# Altium project RoboticArm_DevBoard_V2.PrjPcb
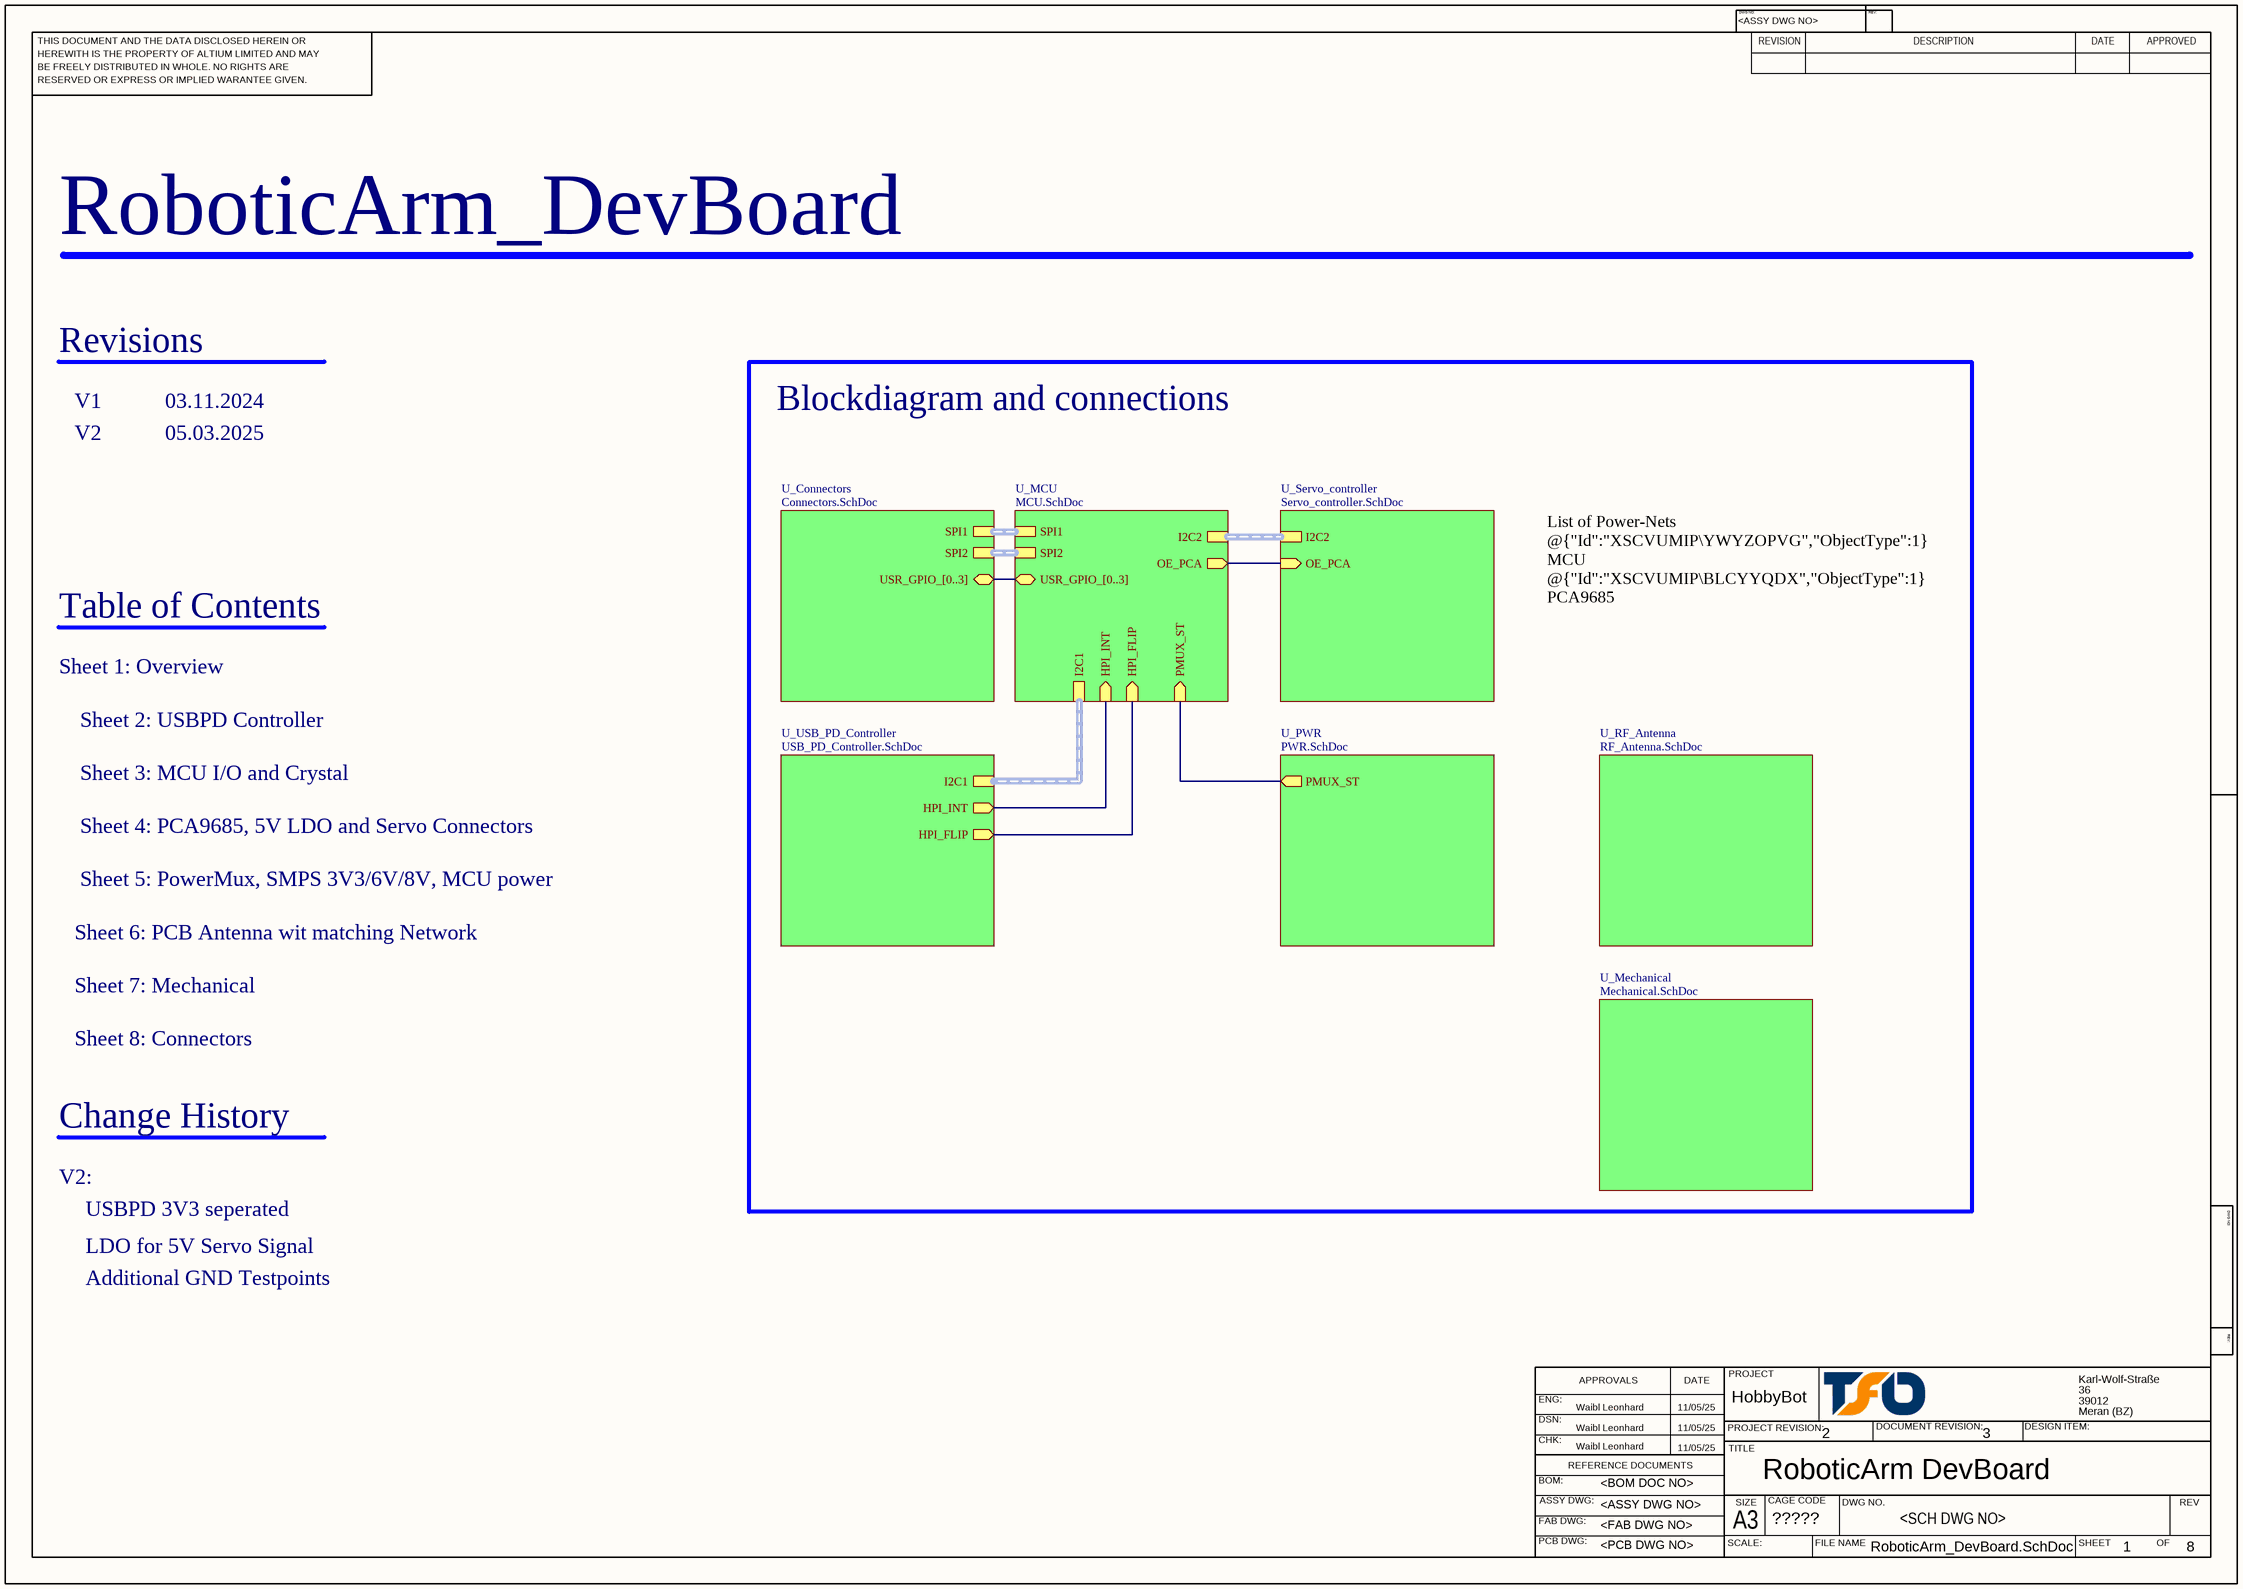
[diagram p0: RoboticArm_DevBoard.SchDoc]
CAGE_CODE: ?????; CONTRACT_NUMBER: <CONTRACT NO>; DOC_NO_ASSY_DWG: <ASSY DWG NO>; DOC_NO_BOM: <BOM DOC NO>; DOC_NO_FAB_DWG: <FAB DWG NO>; DOC_NO_SCH_DWG: <SCH DWG NO>; PCB_2_DEC_TOL: +/-.01; PCB_3_DEC_TOL: +/-.010; PCB_ANG_TOL: +/-1/2; PCB_ASSEMBLY_NO: <PCB ASSY NO>; PCB_CHECKER: - -----; PCB_CHECKER_APP_DATE: --/--/----; PCB_DESIGNER: - -----; PCB_DESIGNER_APP_DATE: --/--/----; PCB_DWG_NO: <PCB DWG NO>; PCB_ENGINEER: - -----; PCB_ENGINEER_APP_DATE: --/--/----; PCB_PART_NUMBER: <PCB PN>; PCB_REV: A; SCH_REV: A
8 sheets, 204 parts. Net scope: hierarchical (ports join the sheet entries above them; power ports are global).
Board file: RoboticArm_DevBoard.PcbDoc
Sheets:
  RoboticArm_DevBoard.SchDoc
    U_MCU = MCU.SchDoc
    U_PWR = PWR.SchDoc
    U_RF_Antenna = RF_Antenna.SchDoc
    U_Servo_controller = Servo_controller.SchDoc
    U_USB_PD_Controller = USB_PD_Controller.SchDoc
    U_Mechanical = Mechanical.SchDoc
    U_Connectors = Connectors.SchDoc

## Sheet RoboticArm_DevBoard.SchDoc: RoboticArm DevBoard
size 420 x 297 mm; Date: 11/05/25; ApprovedBy: Waibl Leonhard; CheckedBy: Waibl Leonhard; Author: Waibl Leonhard; CompanyName: TFO Meran; DrawnBy: Waibl Leonhard; Engineer: Waibl Leonhard; Organization: TFO Meran; Address1: Karl-Wolf-Straße; Address2: 36; Address3: 39012; Address4: Meran (BZ); DocumentNumber: 1; Revision: 2; SheetNumber: 1; SheetTotal: 8; Project: HobbyBot; ENG_APP_DATE: 11/05/25; DSN_APP_DATE: 11/05/25; CHK_APP_DATE: 11/05/25; ProjectRevision: 2; DocumentRevision: 3; ImagePath: C:\Users\Public\Documents\Altium\RoboticArm_DevBoard_V2\images\tfo_logo.jpg; Application_BuildNumber: 2

### Sub-sheets
U_Connectors = Connectors.SchDoc: SPI1 (harness SPI), SPI2 (harness SPI), USR_GPIO_[0..3] (bidir)
U_MCU = MCU.SchDoc: SPI1 (harness *), SPI2 (harness *), I2C1 (harness *), OE_PCA (out), I2C2 (harness *), HPI_FLIP (in), HPI_INT (in), PMUX_ST (in), USR_GPIO_[0..3] (bidir)
U_Mechanical = Mechanical.SchDoc: no entries
U_PWR = PWR.SchDoc: PMUX_ST (out)
U_RF_Antenna = RF_Antenna.SchDoc: no entries
U_Servo_controller = Servo_controller.SchDoc: I2C2 (harness *), OE_PCA (in)
U_USB_PD_Controller = USB_PD_Controller.SchDoc: I2C1 (harness *), HPI_INT (out), HPI_FLIP (out)

### Nets
FLIP: sheet U_MCU/HPI_FLIP, sheet U_USB_PD_Controller/HPI_FLIP
HPI_INT: sheet U_MCU/HPI_INT, sheet U_USB_PD_Controller/HPI_INT
MCU_OE: sheet U_MCU/OE_PCA, sheet U_Servo_controller/OE_PCA
PMUX_ST: sheet U_MCU/PMUX_ST, sheet U_PWR/PMUX_ST

### Buses and harness runs
bus sheet U_Connectors/USR_GPIO_[0..3] = sheet U_MCU/USR_GPIO_[0..3]
harness sheet U_Connectors/SPI1 = sheet U_MCU/SPI1
harness sheet U_Connectors/SPI2 = sheet U_MCU/SPI2
harness sheet U_MCU/I2C1 = sheet U_USB_PD_Controller/I2C1
harness sheet U_MCU/I2C2 = sheet U_Servo_controller/I2C2

### Notes on the sheet
- RoboticArm_DevBoard
- Revisions
- V1
- V2
- 03.11.2024
- 05.03.2025
- Blockdiagram and connections
- Table of Contents
- List of Power-Nets
  @{"Id":"XSCVUMIP\YWYZOPVG","ObjectType":1} MCU
  @{"Id":"XSCVUMIP\BLCYYQDX","ObjectType":1} PCA9685
  @{"Id":"YYHNZXNY\TMXGGDOU","ObjectType":1} Servos
  @{"Id":"YYHNZXNY\GFYATLQU","ObjectType":1} Servos
- Sheet 1: Overview
- Sheet 2: USBPD Controller
- Sheet 3: MCU I/O and Crystal
- Sheet 4: PCA9685, 5V LDO and Servo Connectors
- Sheet 5: PowerMux, SMPS 3V3/6V/8V, MCU power
- Sheet 6: PCB Antenna wit matching Network
- Sheet 7: Mechanical
- Sheet 8: Connectors
- Change History
- V2:
- USBPD 3V3 seperated
- LDO for 5V Servo Signal
- Additional GND Testpoints
- THIS DOCUMENT AND THE DATA DISCLOSED HEREIN OR
- HEREWITH IS THE PROPERTY OF ALTIUM LIMITED AND MAY
- DWG NO:
- REVISION
- REV:
- DESCRIPTION
- DATE
- APPROVED
- BE FREELY DISTRIBUTED IN WHOLE. NO RIGHTS ARE
- RESERVED OR EXPRESS OR IMPLIED WARANTEE GIVEN.
- ENG:
- APPROVALS
- PROJECT
- DSN:
- CHK:
- REFERENCE DOCUMENTS
- PROJECT REVISION:
- TITLE
- DOCUMENT REVISION:
- DESIGN ITEM:
- BOM:
- FAB DWG:
- PCB DWG:
- ASSY DWG:
- SCALE:
- A3
- SIZE
- CAGE CODE
- FILE NAME
- DWG NO.
- SHEET
- OF
- REV

## Sheet MCU.SchDoc
size A3; SheetNumber: 3; SheetTotal: 8
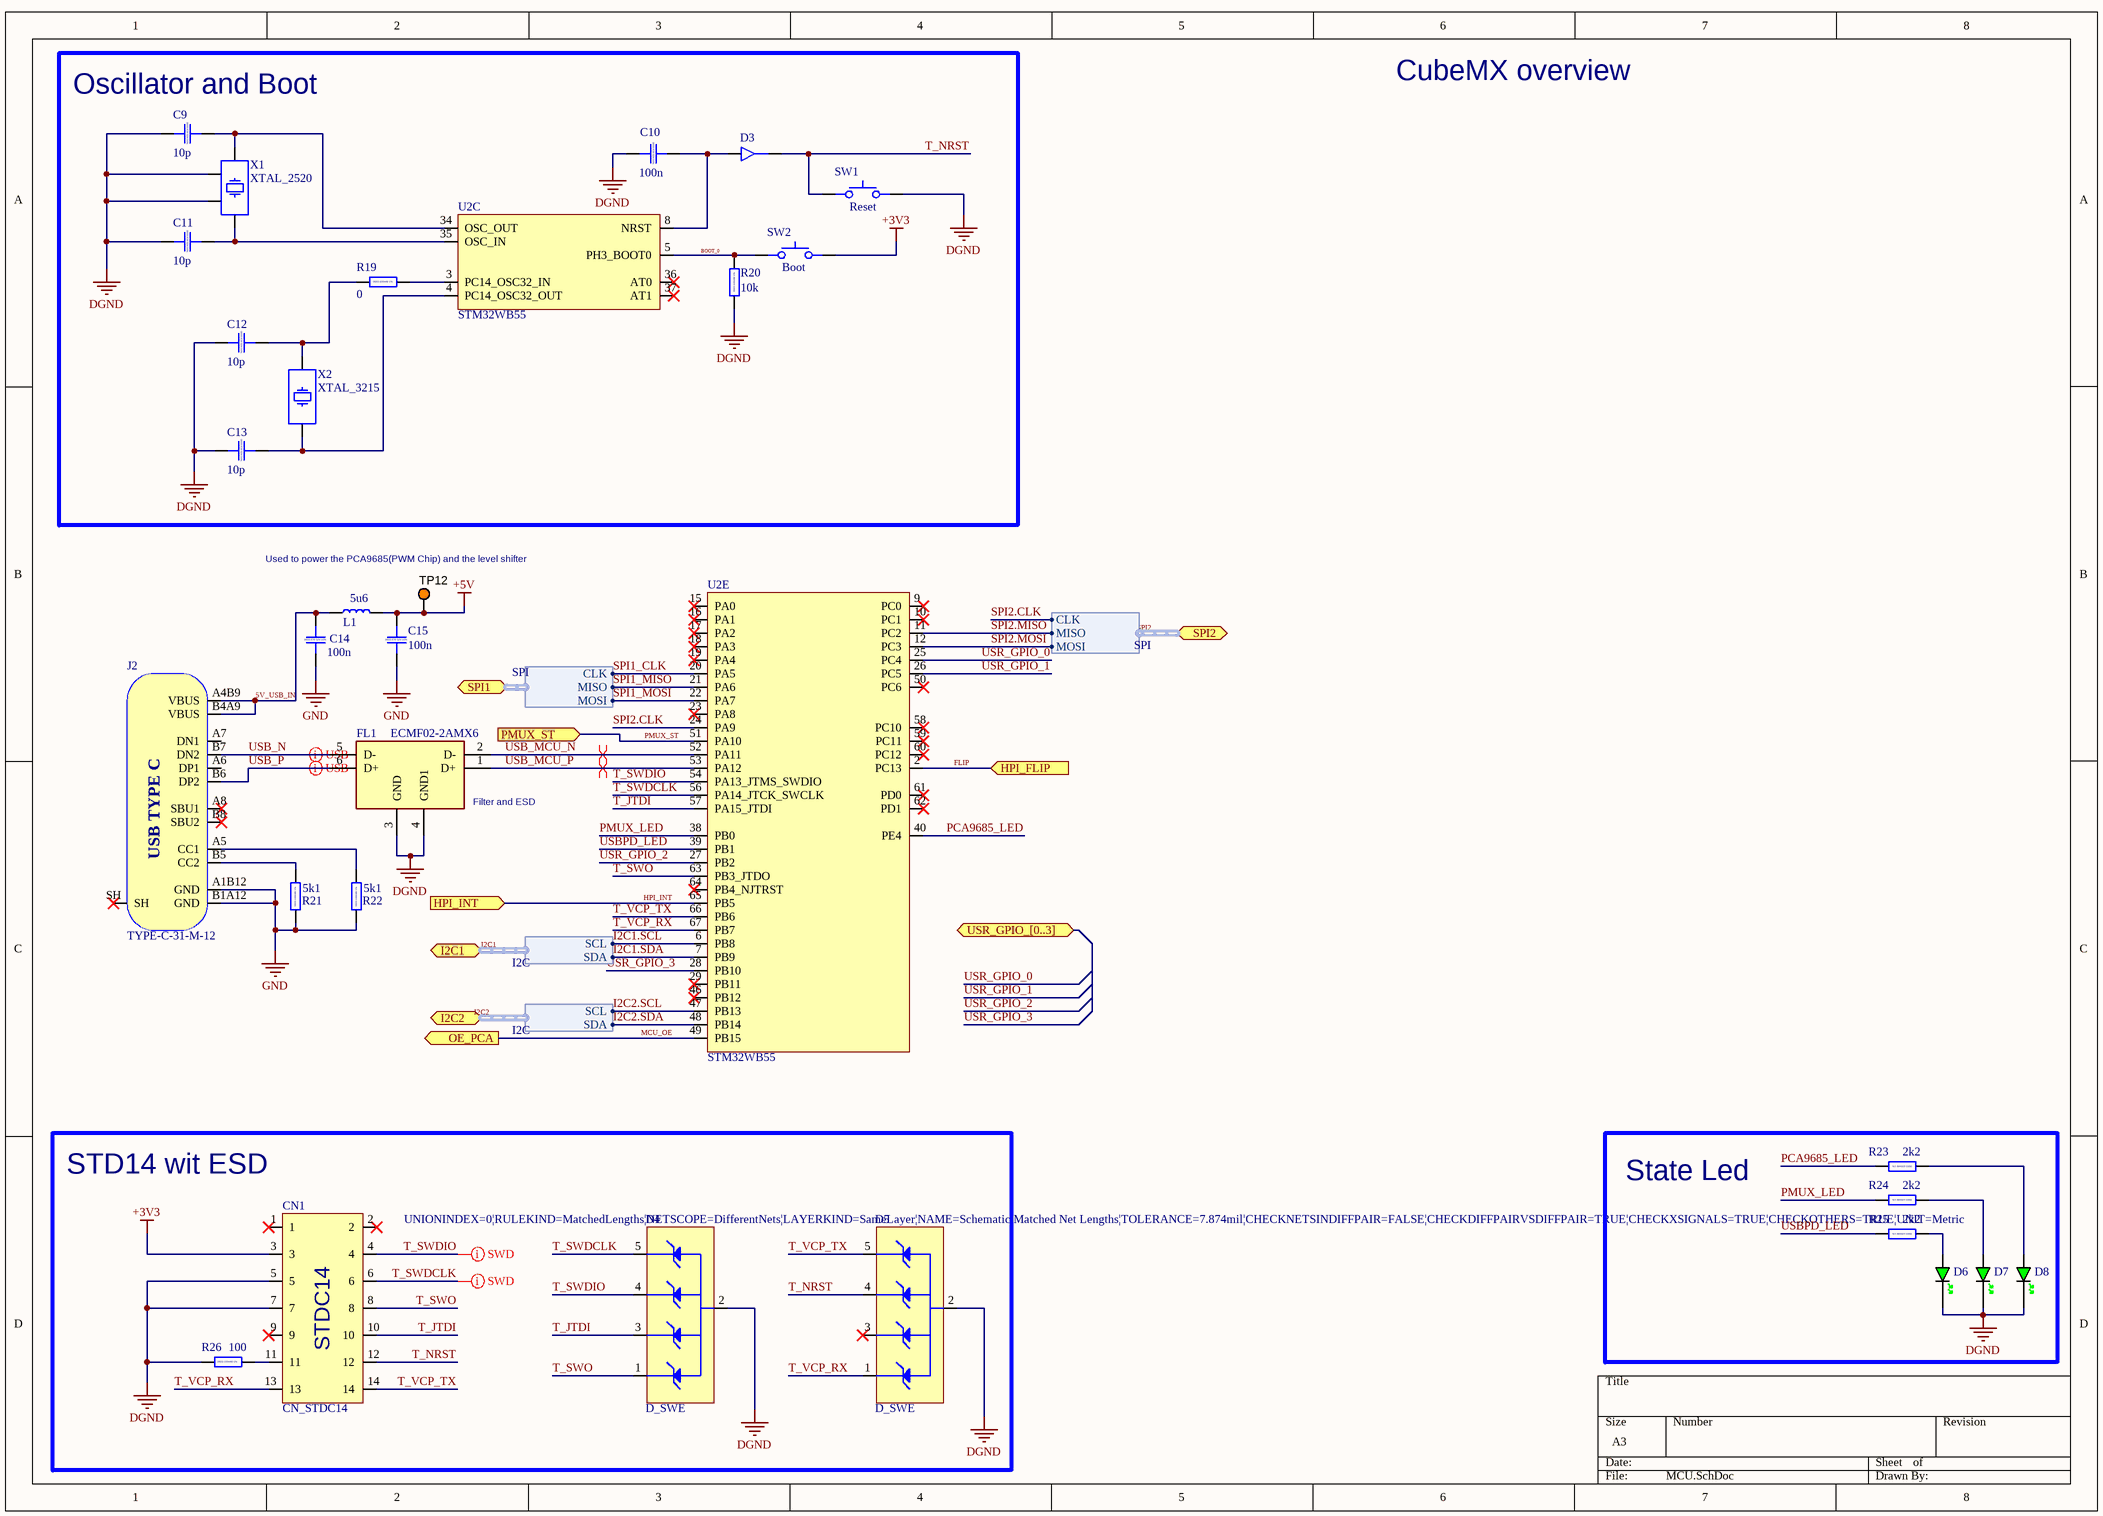
[diagram p1: MCU.SchDoc]

### Parts
C9  10p  [CAP_0603]
C10  100n  [CAP_0603]
C11  10p  [CAP_0603]
C12  10p  [CAP_0603]
C13  10p  [CAP_0603]
C14  100n  [CAP_0603]
C15  100n  [CAP_0603]
CN1  CN_STDC14  [FTSH-107-01-F-DV-K-P-TR-Footprint-1]
D3  D_SOD_323  [SOD-323]  (value not drawn)
D4  D_SWE  [SOT65P210X110-5N]
D5  D_SWE  [SOT65P210X110-5N]
D6  LED_0603_GREEN  [LED_0603_GREEN]  (value not drawn)
D7  LED_0603_GREEN  [LED_0603_GREEN]  (value not drawn)
D8  LED_0603_GREEN  [LED_0603_GREEN]  (value not drawn)
FL1  ECMF02-2AMX6  [FP-QFN-6L-IPC_A]
J2  TYPE-C-31-M-12  [TYPE-C-31-M-12]
L1  5u6  [IND_0603]
R19  0  [RES_0603]
R20  10k  [RES_0603]
R21  5k1  [RES_0603]
R22  5k1  [RES_0603]
R23  2k2  [RES_0603]
R24  2k2  [RES_0603]
R25  2k2  [RES_0603]
R26  100  [RES_0603]
SW1  Reset  [SKRPANE010]
SW2  Boot  [SKRPANE010]
TP12  5003  [KSTN-5003]  (value not drawn)
U2  STM32WB55  [QFN40P800X800X100_HS-69N]  (parts C,E of 5)
X1  XTAL_2520  [XTAL_2520]
X2  XTAL_3215  [XTAL_3215-2]

### Blocks framed on the sheet
Oscillator and Boot: C9-C13 D3 R19 R20 SW1 SW2 U2 X1 X2
STD14 wit ESD: CN1 D4 D5 R26
State Led: D6-D8 R23-R25

### Ports
HPI_FLIP (in), HPI_INT (in), I2C1 (bidir, harness I2C), I2C2 (bidir, harness I2C), OE_PCA (out), PMUX_ST (in), SPI1 (bidir, harness SPI), SPI2 (bidir, harness SPI), USR_GPIO_[0..3] (bidir)

### Harnesses
SPI: CLK, MISO, MOSI
I2C: SCL, SDA

### Nets
+3V3: CN1.3 SW2.34
+5V: C15.1 L1.2 TP12.1
DGND: C9.2 C10.2 C11.2 C12.2 C13.2 CN1.5 CN1.7 D4.2 D5.2 D6.K D7.K D8.K FL1.3(GND) FL1.4(GND1) R20.1 R26.1 SW1.34 X1.2 X1.4
GND: C14.2 C15.2 J2.A1B12(GND) J2.B1A12(GND) R21.1 R22.1
5V_USB_IN: C14.1 J2.A4B9(VBUS) J2.B4A9(VBUS) L1.1
BOOT_0: R20.2 SW2.12 U2.5(PH3_BOOT0)
FLIP: U2.2(PC13) ; port HPI_FLIP
HPI_INT: U2.65(PB5) ; port HPI_INT
I2C1.SCL: U2.6(PB8) ; port I2C1.SCL
I2C1.SDA: U2.7(PB9) ; port I2C1.SDA
I2C2.SCL: U2.47(PB13) ; port I2C2.SCL
I2C2.SDA: U2.48(PB14) ; port I2C2.SDA
MCU_OE: U2.49(PB15) ; port OE_PCA
PCA9685_LED: R23.2 U2.40(PE4)
PMUX_LED: R24.2 U2.38(PB0)
PMUX_ST: U2.51(PA10) ; port PMUX_ST
SPI1_CLK: U2.20(PA5) ; port SPI1.CLK
SPI1_MISO: U2.21(PA6) ; port SPI1.MISO
SPI1_MOSI: U2.22(PA7) ; port SPI1.MOSI
SPI2.CLK: U2.24(PA9) ; port SPI2.CLK
SPI2.MISO: U2.11(PC2) ; port SPI2.MISO
SPI2.MOSI: U2.12(PC3) ; port SPI2.MOSI
T_JTDI: CN1.10 D4.3 U2.57(PA15_JTDI)
T_NRST: CN1.12 D3.K D5.4 SW1.12
T_SWDCLK: CN1.6 D4.5 U2.56(PA14_JTCK_SWCLK)
T_SWDIO: CN1.4 D4.4 U2.54(PA13_JTMS_SWDIO)
T_SWO: CN1.8 D4.1 U2.63(PB3_JTDO)
T_VCP_RX: CN1.13 D5.1 U2.67(PB7)
T_VCP_TX: CN1.14 D5.5 U2.66(PB6)
USB_MCU_N: FL1.2(D-) U2.52(PA11)
USB_MCU_P: FL1.1(D+) U2.53(PA12)
USB_N: FL1.5(D-) J2.B7(DN2)
USB_P: FL1.6(D+) J2.B6(DP2)
USBPD_LED: R25.2 U2.39(PB1)
USR_GPIO_0: U2.25(PC4)
USR_GPIO_1: U2.26(PC5)
USR_GPIO_2: U2.27(PB2)
USR_GPIO_3: U2.28(PB10)
NetC9_1: C9.1 U2.34(OSC_OUT) X1.1
NetC10_1: C10.1 D3.A U2.8(NRST)
NetC11_1: C11.1 U2.35(OSC_IN) X1.3
NetC12_1: C12.1 R19.1 X2.2
NetC13_1: C13.1 U2.4(PC14_OSC32_OUT) X2.1
NetCN1_11: CN1.11 R26.2
NetD6_A: D6.A R25.1
NetD7_A: D7.A R24.1
NetD8_A: D8.A R23.1
NetJ2_A5: J2.A5(CC1) R22.2
NetJ2_B5: J2.B5(CC2) R21.2
NetR19_2: R19.2 U2.3(PC14_OSC32_IN)

Not connected (* = marked no-connect by the designer): CN1 1* 2* 9*; D5 3*; J2 A6(DP1) A7(DN1) A8(SBU1)* B8(SBU2)* SH*; U2 9(PC0)* 10(PC1)* 15(PA0)* 16(PA1)* 17(PA2)* 18(PA3)* 19(PA4)* 23(PA8)* 29(PB11)* 36(AT0)* 37(AT1)* 46(PB12)* 50(PC6)* 58(PC10)* 59(PC11)* 60(PC12)* 61(PD0)* 62(PD1)* 64(PB4_NJTRST)*

### Buses and harness runs
harness I2C1 = port I2C1
harness I2C2 = port I2C2
harness SPI2 = port SPI2

### Layout directives
differential pair; differential pair class DIFF_USB: USB_MCU_N, USB_MCU_P, USB_N, USB_P
rule Matched Net Lengths [Tolerance = 0.2mm]; net class SWDIO: T_SWDCLK, T_SWDIO

### Notes on the sheet
- CubeMX overview
- Used to power the PCA9685(PWM Chip) and the level shifter
- (near FL1) Filter and ESD
- (in symbol CMP-001-00113-3) 0603 X7R 50V 10%
- (in symbol CMP-002-00119-1) USB TYPE C
- (in symbol CMP-002-00331-1) STDC14
- (in symbol CMP-009-00179-5) 0603 100mW 1%

### Library data of the parts
C9-C15 = CMP-001-00113-3: Capacitor SMD 0603; Manufacturer: *; Rating: *; Distributor Link: *; Source: Schematic-Lib-PhilsLab.SchLib; Manufacturer Part Number: *; Dielectric: *; LCSC: *; Design Item ID: CAP_0603
  C9 C11-C13: Value: 10p
  C10 C14 C15: Value: 100n
CN1 = CMP-002-00331-1: Board Connector, 14 Contact(s), 2 Row(s), Male, Straight, 0.05 inch Pitch, Surface Mount Terminal, Locking; RoHS Compliant: Yes; Mounting Technology: Board; Connector Type: BOARD CONNECTOR
D3 = CMP-004-00140-1: Diode SMD SOD-323; Source: Schematic-Lib-PhilsLab.SchLib; Design Item ID: D_SOD_323
D4 D5 = CMP-004-00138-2: ESDALC6V1W5 Trans Voltage Suppressor Diode, 25W, Unidirectional, 4 Element, Silicon; Pins: 5; RoHS Compliant: Yes; Max Operating Temperature: 150°C
D6-D8 = CMP-004-00051-1: LED 0603 GREEN SMD; Source: Schematic-Lib-PhilsLab.SchLib; Design Item ID: LED_0603_GREEN
FL1 = CMP-031-00232-5: Data Line Filter, 2 Function(s), 6 Pin(s), Plastic; Max Operating Temperature: 85°C; Min Operating Temperature: -40°C; Mounting Technology: Surface Mount; RoHS Compliant: Yes; Pins: 6
J2 = CMP-002-00119-1: USB Type C Connector Horizontal SMT; Manufacturer: Koren Hroparts; Source: Schematic-Lib-PhilsLab.SchLib; Manufacturer Part Number: TYPE-C-31-M-12; Design Item ID: TYPE-C-31-M-12
L1 = CMP-006-00026-1: Inductor SMD 0603; Design Item ID: IND_0603; Source: Schematic-Lib-PhilsLab.SchLib
R19-R26 = CMP-009-00179-5: Resistor 0603 100mW 1%; LCSC: *; Distributor Link: *; Manufacturer Part Number: *; Design Item ID: RES_0603; Manufacturer: *; Source: Schematic-Lib-PhilsLab.SchLib
  R19: Value: 0
  R20: Value: 10k
  R21 R22: Value: 5k1
  R23-R25: Value: 2k2
  R26: Value: 100
SW1 SW2 = CMP-011-00019-1: Tactile Switch SMD SPST; Manufacturer: Alps Alpine; Manufacturer Part Number: SKRPANE010; Source: Schematic-Lib-PhilsLab.SchLib; Design Item ID: SKRPANE010
TP12 = CMP-002-00037-2: Test Point, Orange, Height 4.6 mm, Tail Length 3 mm, 1-Pin THD, RoHS; Manufacturer: Keystone; Colour: Orange; Packaging: Bulk; Package Description: 1-Pin Through Hole Device, Dia 2.54 mm; Pins: 1; Package Reference: 5003; Datasheet Version: Jun-15; Case/Package: 5003; Mounting Technology: TH; Connector Type: TestPoint; Diameter: 2.54mm; Contact Material: Bronze; Datasheet URL: http://keyelco.com/userAssets/file/M65p56.pdf; Manufacturer URL: http://www.keyelco.com/; Package Quantity: 10; Contact Plating: Tin; RoHS Compliant: True
U2 = CMP-031-00230-3: Multiprotocol wireless 32-bit MCU Arm®-based Cortex®-M4
X1 = CMP-003-00031-1: Crystal SMD 2520; Distributor Link: *; Design Item ID: XTAL_2520; Source: Schematic-Lib-PhilsLab.SchLib
X2 = CMP-003-00032-1: Crystal SMD 3215; Source: Schematic-Lib-PhilsLab.SchLib; Distributor Link: *; Design Item ID: XTAL_3215

## Sheet PWR.SchDoc
size A3; SheetNumber: 5; SheetTotal: 8
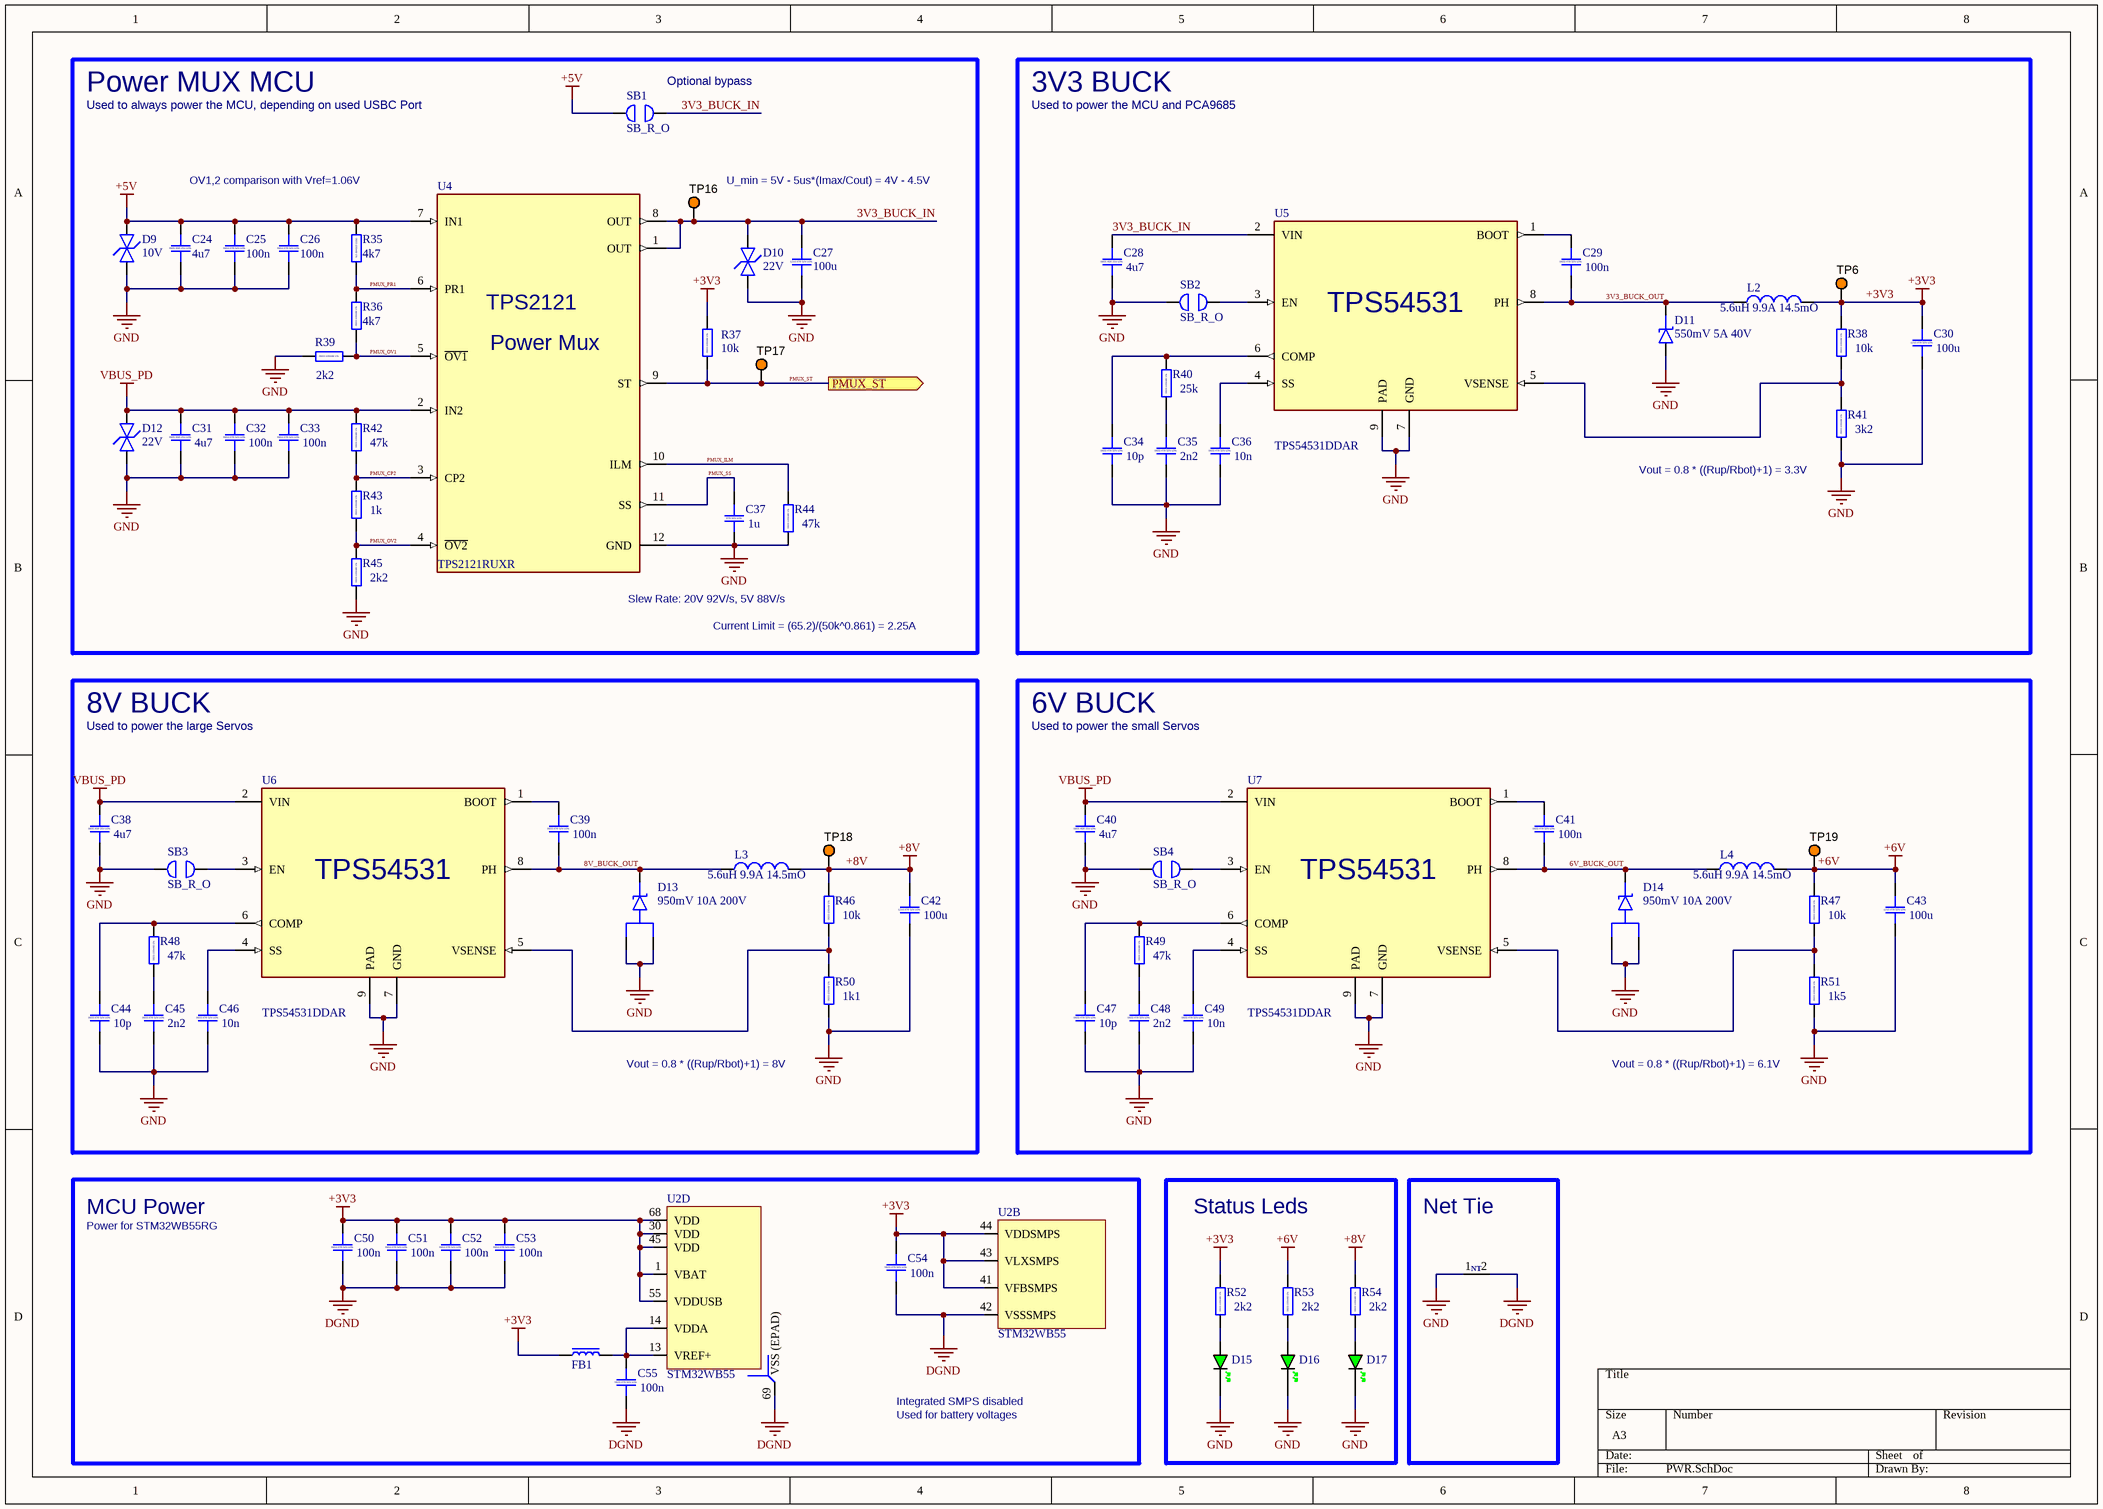
[diagram p2: PWR.SchDoc]

### Parts
C24  4u7  [CAP_0805]
C25  100n  [CAP_0603]
C26  100n  [CAP_0603]
C27  100u  [CAP_1210]
C28  4u7  [CAP_0805]
C29  100n  [CAP_0603]
C30  100u  [CAP_1210]
C31  4u7  [CAP_0805]
C32  100n  [CAP_0603]
C33  100n  [CAP_0603]
C34  10p  [CAP_0603]
C35  2n2  [CAP_0603]
C36  10n  [CAP_0603]
C37  1u  [CAP_0603]
C38  4u7  [CAP_0805]
C39  100n  [CAP_0603]
C40  4u7  [CAP_0805]
C41  100n  [CAP_0603]
C42  100u  [CAP_1210]
C43  100u  [CAP_1210]
C44  10p  [CAP_0603]
C45  2n2  [CAP_0603]
C46  10n  [CAP_0603]
C47  10p  [CAP_0603]
C48  2n2  [CAP_0603]
C49  10n  [CAP_0603]
C50  100n  [CAP_0603]
C51  100n  [CAP_0603]
C52  100n  [CAP_0603]
C53  100n  [CAP_0603]
C54  100n  [CAP_0603]
C55  100n  [CAP_0603]
D9  10V  [D_0603]
D10  22V  [D_0603]
D11  550mV 5A 40V  [SMC-DO-214AB]
D12  22V  [D_0603]
D13  950mV 10A 200V  [DPAK230P970X240-3N]
D14  950mV 10A 200V  [DPAK230P970X240-3N]
D15  LED_0603_GREEN  [LED_0603_GREEN]  (value not drawn)
D16  LED_0603_GREEN  [LED_0603_GREEN]  (value not drawn)
D17  LED_0603_GREEN  [LED_0603_GREEN]  (value not drawn)
FB1  FB_0603  [FB_0603]  (value not drawn)
L2  5.6uH 9.9A 14.5mO  [INDP6466X61N]
L3  5.6uH 9.9A 14.5mO  [INDP6466X61N]
L4  5.6uH 9.9A 14.5mO  [INDP6466X61N]
NT1  NetTie_1mm  [NETTIE]  (value not drawn)  (net tie, no BOM)
R35  4k7  [RES_0603]
R36  4k7  [RES_0603]
R37  10k  [RES_0603]
R38  10k  [RES_0603]
R39  2k2  [RES_0603]
R40  25k  [RES_0603]
R41  3k2  [RES_0603]
R42  47k  [RES_0603]
R43  1k  [RES_0603]
R44  47k  [RES_0603]
R45  2k2  [RES_0603]
R46  10k  [RES_0603]
R47  10k  [RES_0603]
R48  47k  [RES_0603]
R49  47k  [RES_0603]
R50  1k1  [RES_0603]
R51  1k5  [RES_0603]
R52  2k2  [RES_0603]
R53  2k2  [RES_0603]
R54  2k2  [RES_0603]
SB1  SB_R_O  [New footprint 1]
SB2  SB_R_O  [New footprint 1]
SB3  SB_R_O  [New footprint 1]
SB4  SB_R_O  [New footprint 1]
TP6  5003  [KSTN-5003]  (value not drawn)
TP16  5003  [KSTN-5003]  (value not drawn)
TP17  5003  [KSTN-5003]  (value not drawn)
TP18  5003  [KSTN-5003]  (value not drawn)
TP19  5003  [KSTN-5003]  (value not drawn)
U2  STM32WB55  [QFN40P800X800X100_HS-69N]  (parts B,D of 5)
U4  TPS2121RUXR  [FP-RUX0012A-MFG]
U5  TPS54531DDAR  [FP-DDA0008E-IPC_A]
U6  TPS54531DDAR  [FP-DDA0008E-IPC_A]
U7  TPS54531DDAR  [FP-DDA0008E-IPC_A]

### Blocks framed on the sheet
Power MUX MCU: C24-C27 C31-C33 C37 D9 D10 D12 R35-R37 R39 R42-R45 SB1 TP16 TP17 U4
3V3 BUCK: C28-C30 C34-C36 D11 L2 R38 R40 R41 SB2 TP6 U5
8V BUCK: C38 C39 C42 C44-C46 D13 L3 R46 R48 R50 SB3 TP18 U6
6V BUCK: C40 C41 C43 C47-C49 D14 L4 R47 R49 R51 SB4 TP19 U7
MCU Power: C50-C55 FB1 U2
Status Leds: D15-D17 R52-R54
Net Tie: NT1

### Ports
PMUX_ST (out)

### Nets
+3V3: C30.2 C50.1 C51.1 C52.1 C53.1 C54.1 FB1.1 L2.2 R37.2 R38.2 R52.2 TP6.1 U2.1(VBAT) U2.30(VDD) U2.41(VFBSMPS) U2.43(VLXSMPS) U2.44(VDDSMPS) U2.45(VDD) U2.55(VDDUSB) U2.68(VDD)
+5V: C24.2 C25.1 C26.1 D9.K R35.1 SB1.1 U4.7(IN1)
+6V: C43.2 L4.2 R47.2 R53.2 TP19.1
+8V: C42.2 L3.2 R46.2 R54.2 TP18.1
DGND: C50.2 C51.2 C52.2 C53.2 C54.2 C55.2 NT1.2 U2.42(VSSSMPS) U2.69(VSS_(EPAD))
GND: C24.1 C25.2 C26.2 C27.1 C28.1 C30.1 C31.1 C32.2 C33.2 C34.2 C35.2 C36.2 C37.2 C38.1 C40.1 C42.1 C43.1 C44.2 C45.2 C46.2 C47.2 C48.2 C49.2 D9.A D10.A D11.A D12.A D13.1(A) D13.2(A1) D14.1(A) D14.2(A1) D15.K D16.K D17.K NT1.1 R39.1 R41.1 R44.1 R45.1 R50.1 R51.1 SB2.1 SB3.1 SB4.1 U4.12(GND) U5.7(GND) U5.9(PAD) U6.7(GND) U6.9(PAD) U7.7(GND) U7.9(PAD)
VBUS_PD: C31.2 C32.1 C33.1 C38.2 C40.2 D12.K R42.2 U4.2(IN2) U6.2(VIN) U7.2(VIN)
3V3_BUCK_IN: C27.2 C28.2 D10.K SB1.2 TP16.1 U4.1(OUT) U4.8(OUT) U5.2(VIN)
3V3_BUCK_OUT: C29.2 D11.K L2.1 U5.8(PH)
6V_BUCK_OUT: C41.2 D14.3(K) L4.1 U7.8(PH)
8V_BUCK_OUT: C39.2 D13.3(K) L3.1 U6.8(PH)
PMUX_CP2: R42.1 R43.2 U4.3(CP2)
PMUX_ILM: R44.2 U4.10(ILM)
PMUX_OV1: R36.1 R39.2 U4.5(~{OV1})
PMUX_OV2: R43.1 R45.2 U4.4(~{OV2})
PMUX_PR1: R35.2 R36.2 U4.6(PR1)
PMUX_SS: C37.1 U4.11(SS)
PMUX_ST: R37.1 TP17.1 U4.9(ST) ; port PMUX_ST
NetC29_1: C29.1 U5.1(BOOT)
NetC34_1: C34.1 R40.2 U5.6(COMP)
NetC35_1: C35.1 R40.1
NetC36_1: C36.1 U5.4(SS)
NetC39_1: C39.1 U6.1(BOOT)
NetC41_1: C41.1 U7.1(BOOT)
NetC44_1: C44.1 R48.2 U6.6(COMP)
NetC45_1: C45.1 R48.1
NetC46_1: C46.1 U6.4(SS)
NetC47_1: C47.1 R49.2 U7.6(COMP)
NetC48_1: C48.1 R49.1
NetC49_1: C49.1 U7.4(SS)
NetC55_1: C55.1 FB1.2 U2.13(VREF+) U2.14(VDDA)
NetD15_A: D15.A R52.1
NetD16_A: D16.A R53.1
NetD17_A: D17.A R54.1
NetR38_1: R38.1 R41.2 U5.5(VSENSE)
NetR46_1: R46.1 R50.2 U6.5(VSENSE)
NetR47_1: R47.1 R51.2 U7.5(VSENSE)
NetSB2_2: SB2.2 U5.3(EN)
NetSB3_2: SB3.2 U6.3(EN)
NetSB4_2: SB4.2 U7.3(EN)

### Notes on the sheet
- Used to always power the MCU, depending on used USBC Port
- (near SB1) Optional bypass
- Used to power the MCU and PCA9685
- OV1,2 comparison with Vref=1.06V
- (near TP16) U_min = 5V - 5us*(Imax/Cout) = 4V - 4.5V
- (near R41) Vout = 0.8 * ((Rup/Rbot)+1) = 3.3V
- Slew Rate: 20V 92V/s, 5V 88V/s
- Current Limit = (65.2)/(50k^0.861) = 2.25A
- Used to power the large Servos
- Used to power the small Servos
- Vout = 0.8 * ((Rup/Rbot)+1) = 8V
- Vout = 0.8 * ((Rup/Rbot)+1) = 6.1V
- Power for STM32WB55RG
- Integrated SMPS disabled
- Used for battery voltages
- (in symbol CMP-001-00113-2) X7R 50V 10%
- (in symbol CMP-001-00113-3) 0603 X7R 50V 10%
- (in symbol CMP-001-38826-1) 0805 X5R 25V 10%
- (in symbol CMP-001-38827-2) 1210 X7R 50V 10%
- (in symbol CMP-009-00179-5) 0603 100mW 1%
- (in symbol CMP-019-00049-4) TPS2121; Power Mux
- (in symbol CMP-024-000416-1) NT
- (in symbol CMP-031-00231-2) TPS54531

### Library data of the parts
C24 C28 C31 C38 C40 = CMP-001-38826-1: Capacitor SMD 0805; Manufacturer Part Number: *; Rating: *; Dielectric: *; Design Item ID: CAP_0805; Manufacturer: *; Distributor Link: *; LCSC: *; Source: Schematic-Lib-PhilsLab.SchLib
  C24: Value: 4u7
C25 C26 C29 C32-C36 C39 C41 C44-C55 = CMP-001-00113-3: Capacitor SMD 0603; Manufacturer: *; Rating: *; Distributor Link: *; Source: Schematic-Lib-PhilsLab.SchLib; Manufacturer Part Number: *; Dielectric: *; LCSC: *; Design Item ID: CAP_0603
  C25 C26: Value: 100n
C27 C30 C42 C43 = CMP-001-38827-2: Capacitor SMD 1210; Design Item ID: CAP_1210; Manufacturer: *; Source: Schematic-Lib-PhilsLab.SchLib; Manufacturer Part Number: *; Distributor Link: *; Rating: *; Dielectric: *; LCSC: *
C37 = CMP-001-00113-2: Capacitor SMD 0603; LCSC: *; Rating: *; Dielectric: *; Design Item ID: CAP_0603; Distributor Link: *; Manufacturer: *; Source: Schematic-Lib-PhilsLab.SchLib; Manufacturer Part Number: *
D9 D10 D12 = CMP-004-00043-1: Diode TVS / ESD Bidirectional 0603; Source: Schematic-Lib-PhilsLab.SchLib; Manufacturer: *; Design Item ID: D_TVS_BI_0603; Manufacturer Part Number: *
D11 = CMP-004-00048-1: Diode Schottky SMD SMC (DO-214AB); Distributor Link: *; Design Item ID: D_SCHOTTKY_SMC; Source: Schematic-Lib-PhilsLab.SchLib
D13 D14 = CMP-004-00137-2: Diode Schottky DPAK; Design Item ID: D_SCHOTTKY_SMA; Source: Schematic-Lib-PhilsLab.SchLib
D15-D17 = CMP-004-00051-1: LED 0603 GREEN SMD; Source: Schematic-Lib-PhilsLab.SchLib; Design Item ID: LED_0603_GREEN
FB1 = CMP-006-00022-1: Ferrite Bead SMD 0603; Manufacturer Part Number: *; LCSC: *; Manufacturer: *; Distributor Link: *; Source: Schematic-Lib-PhilsLab.SchLib; Design Item ID: FB_0603
L2-L4 = CMP-006-00096-1: Max Current Rating: 10A; Self Resonant Frequency: 20MHz; Tolerance: 20%; RoHS Compliant: Yes; Max Operating Temperature: 165°C; Min Operating Temperature: -40°C; Pins: 2
NT1 = CMP-024-000416-1: Net Tie; Design Item ID: NetTie; Source: Schematic-Lib-PhilsLab.SchLib
R35-R54 = CMP-009-00179-5: Resistor 0603 100mW 1%; LCSC: *; Distributor Link: *; Manufacturer Part Number: *; Design Item ID: RES_0603; Manufacturer: *; Source: Schematic-Lib-PhilsLab.SchLib
  R35 R36: Value: 4k7
  R39: Value: 2k2
SB1-SB4 = CMP-00000-3: Solderbridge Round and Open
TP6 TP16-TP19 = CMP-002-00037-2: as TP12 on sheet MCU; Colour: Orange; Packaging: Bulk; Package Description: 1-Pin Through Hole Device, Dia 2.54 mm; Pins: 1; Package Reference: 5003; Datasheet Version: Jun-15; Case/Package: 5003; Mounting Technology: TH; Connector Type: TestPoint; Diameter: 2.54mm; Contact Material: Bronze; Datasheet URL: http://keyelco.com/userAssets/file/M65p56.pdf; Manufacturer URL: http://www.keyelco.com/; Package Quantity: 10; Contact Plating: Tin; RoHS Compliant: True
U2 = CMP-031-00230-3: as U2 on sheet MCU
U4 = CMP-019-00049-4: Power Supply Support Circuit, Adjustable, 1 Channel, PQCC12; RoHS Compliant: Yes
U5-U7 = CMP-031-00231-2: Switching Regulator, Current-mode, 5A, 570kHz Switching Freq-Max, PDSO8; Max Supply Voltage: 28V; Pins: 8; RoHS Compliant: Yes; Min Operating Temperature: -40°C; Max Operating Temperature: 85°C; Case/Package: HLSOP

## Sheet RF_Antenna.SchDoc
size A4; SheetNumber: 6; SheetTotal: 8
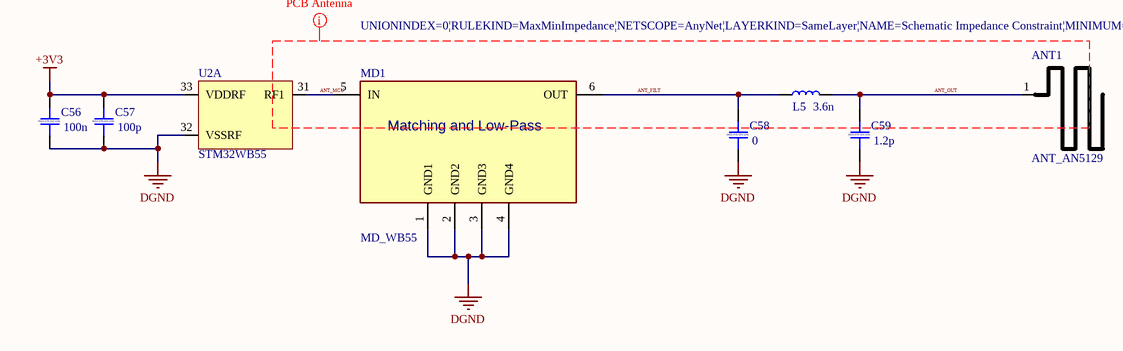
[diagram p3: RF_Antenna.SchDoc]

### Parts
ANT1  ANT_AN5129  [ANT_AN5129-Footprint-1]
C56  100n  [CAP_0603]
C57  100p  [CAP_0603]
C58  0  [CAP_0603]
C59  1.2p  [CAP_0603]
L5  3.6n  [IND_0603]
MD1  MD_WB55  [FP-MLPF-WB55-01E3-MFG]
U2  STM32WB55  [QFN40P800X800X100_HS-69N]  (part A of 5)

### Nets
+3V3: C56.1 C57.1 U2.33(VDDRF)
DGND: C56.2 C57.2 C58.2 C59.2 MD1.1(GND1) MD1.2(GND2) MD1.3(GND3) MD1.4(GND4) U2.32(VSSRF)
ANT_FILT: C58.1 L5.1 MD1.6(OUT)
ANT_MCU: MD1.5(IN) U2.31(RF1)
ANT_OUT: ANT1.1 C59.1 L5.2

### Layout directives
rule Impedance Constraint [Min = 45.00    Max = 55.00    ]: ANT_FILT, ANT_MCU, ANT_OUT

### Notes on the sheet
- (in symbol CMP-001-00113-3) 0603 X7R 50V 10%
- (in symbol CMP-00025-00004-1) Matching and Low-Pass

### Library data of the parts
ANT1 = CMP-00025-00003-3: PCB Antenna from ST AN5129
C56-C59 = CMP-001-00113-3: Capacitor SMD 0603; Manufacturer: *; Rating: *; Distributor Link: *; Source: Schematic-Lib-PhilsLab.SchLib; Manufacturer Part Number: *; Dielectric: *; LCSC: *; Design Item ID: CAP_0603
L5 = CMP-006-00026-1: Inductor SMD 0603; Design Item ID: IND_0603; Source: Schematic-Lib-PhilsLab.SchLib
MD1 = CMP-00025-00004-1: Low Pass Filter
U2 = CMP-031-00230-3: as U2 on sheet MCU

## Sheet Servo_controller.SchDoc
size A4; SheetNumber: 4; SheetTotal: 8
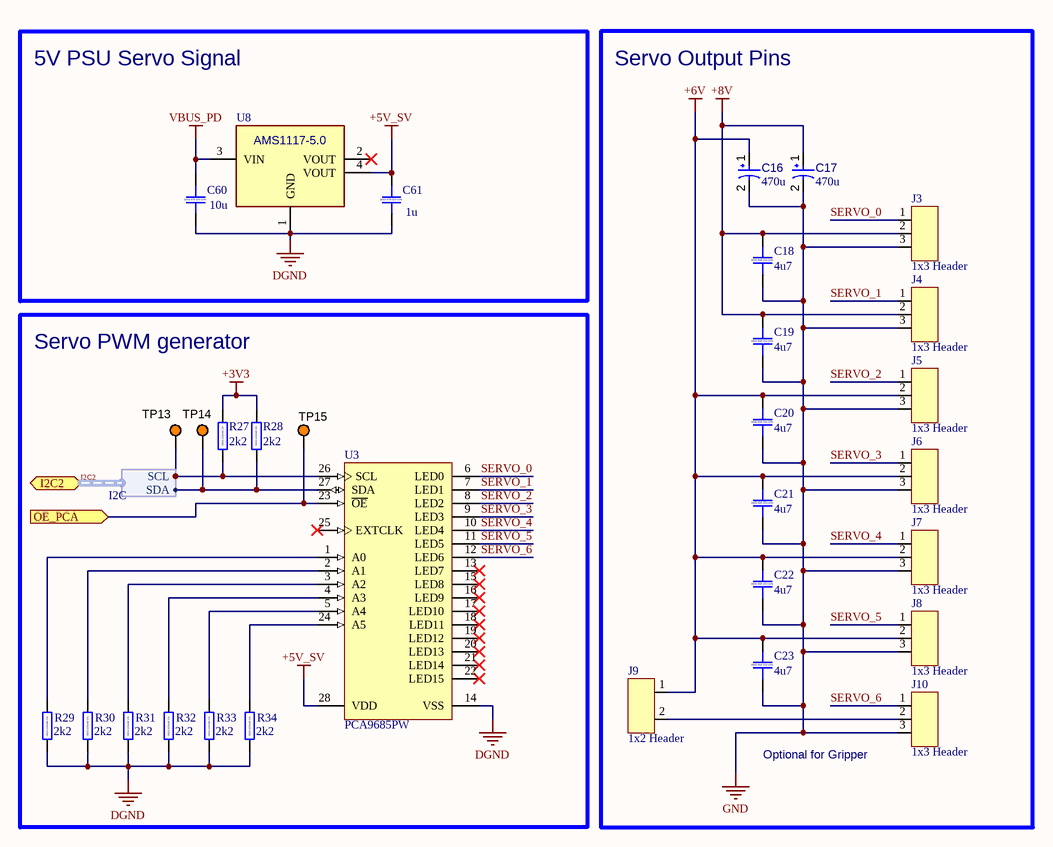
[diagram p4: Servo_controller.SchDoc]

### Parts
C16  value 470u  [CAPPR65-500-2000X1000X2200]  (hidden comment: CAP_TH_5)
C17  value 470u  [CAPPR65-500-2000X1000X2200]  (hidden comment: CAP_TH_5)
C18  4u7  [CAP_0805]
C19  4u7  [CAP_0805]
C20  4u7  [CAP_0805]
C21  4u7  [CAP_0805]
C22  4u7  [CAP_0805]
C23  4u7  [CAP_0805]
C60  10u  [CAP_0603]
C61  1u  [CAP_0603]
J3  1x3 Header  [1x4 Header-Footprint-1]
J4  1x3 Header  [1x4 Header-Footprint-1]
J5  1x3 Header  [1x4 Header-Footprint-1]
J6  1x3 Header  [1x4 Header-Footprint-1]
J7  1x3 Header  [1x4 Header-Footprint-1]
J8  1x3 Header  [1x4 Header-Footprint-1]
J9  1x2 Header  [1x2 Header-Footprint-1]
J10  1x3 Header  [1x4 Header-Footprint-1]
R27  2k2  [RES_0603]
R28  2k2  [RES_0603]
R29  2k2  [RES_0603]
R30  2k2  [RES_0603]
R31  2k2  [RES_0603]
R32  2k2  [RES_0603]
R33  2k2  [RES_0603]
R34  2k2  [RES_0603]
TP13  5003  [KSTN-5003]  (value not drawn)
TP14  5003  [KSTN-5003]  (value not drawn)
TP15  5003  [KSTN-5003]  (value not drawn)
U3  PCA9685PW  [SOT361-1_V]
U8  AMS1117-5.0  [FP-AMS1117-IPC_B]  (value not drawn)

### Blocks framed on the sheet
5V PSU Servo Signal: C60 C61 U8
Servo Output Pins: C16-C23 J3-J10
Servo PWM generator: R27-R34 TP13-TP15 U3

### Ports
I2C2 (bidir, harness I2C), OE_PCA (in)

### Harnesses
I2C: SCL, SDA

### Nets
+3V3: R27.2 R28.2
+5V_SV: C61.1 U3.28(VDD) U8.4(VOUT)
+6V: C16.1 C20.2 C21.2 C22.2 C23.2 J5.2 J6.2 J7.2 J8.2 J9.1
+8V: C17.1 C18.2 C19.2 J3.2 J4.2
DGND: C60.2 C61.2 R29.1 R30.1 R31.1 R32.1 R33.1 R34.1 U3.14(VSS) U8.1(GND)
GND: C16.2 C17.2 C18.1 C19.1 C20.1 C21.1 C22.1 C23.1 J3.3 J4.3 J5.3 J6.3 J7.3 J8.3 J10.3
VBUS_PD: C60.1 U8.3(VIN)
I2C2.SCL: R27.1 TP13.1 U3.26(SCL) ; port I2C2.SCL
I2C2.SDA: R28.1 TP14.1 U3.27(SDA) ; port I2C2.SDA
MCU_OE: TP15.1 U3.23(~{OE}) ; port OE_PCA
SERVO_0: J3.1 U3.6(LED0)
SERVO_1: J4.1 U3.7(LED1)
SERVO_2: J5.1 U3.8(LED2)
SERVO_3: J6.1 U3.9(LED3)
SERVO_4: J7.1 U3.10(LED4)
SERVO_5: J8.1 U3.11(LED5)
SERVO_6: J10.1 U3.12(LED6)
NetJ9_2: J9.2 J10.2
NetR29_2: R29.2 U3.1(A0)
NetR30_2: R30.2 U3.2(A1)
NetR31_2: R31.2 U3.3(A2)
NetR32_2: R32.2 U3.4(A3)
NetR33_2: R33.2 U3.5(A4)
NetR34_2: R34.2 U3.24(A5)

Not connected (* = marked no-connect by the designer): U3 13(LED7)* 15(LED8)* 16(LED9)* 17(LED10)* 18(LED11)* 19(LED12)* 20(LED13)* 21(LED14)* 22(LED15)* 25(EXTCLK)*; U8 2(VOUT)*

### Buses and harness runs
harness I2C2 = port I2C2

### Notes on the sheet
- (near J10) Optional for Gripper
- (in symbol CMP-001-00113-3) 0603 X7R 50V 10%
- (in symbol CMP-001-38826-1) 0805 X5R 25V 10%
- (in symbol CMP-009-00179-5) 0603 100mW 1%

### Library data of the parts
C16 C17 = CMP-001-38829-1: Aluminum Electrolytic Capacitor, 2-Pin THD; Manufacturer: Panasonic; Voltage Rating: 50V; Ripple Current: 650mA; Tolerance: 20%; Packaging: Bulk; Package Reference: CAPPR65-500-2000X1000X2200; Pins: 2; Manufacturer URL: http://www.panasonic.com/; Datasheet Version: Mar-16; Case/Package: Radial; Package Quantity: 200; Datasheet URL: http://industrial.panasonic.com/cdbs/www-data/pdf/RDF0000/ABA0000C1047.pdf; RoHS Compliant: True; Package Description: 2-Pin Radial Lead, Dia 10 mm, Height 22 mm; Lead Pitch: 5mm; Capacitor Type: Electrolytic; Max Operating Temperature: 85°C; Ripple Current (AC): 650mA; Mounting Technology: TH; Min Operating Temperature: -40°C; Diameter: 10mm
C18-C23 = CMP-001-38826-1: Capacitor SMD 0805; Manufacturer Part Number: *; Rating: *; Dielectric: *; Design Item ID: CAP_0805; Manufacturer: *; Value: 4u7; Distributor Link: *; LCSC: *; Source: Schematic-Lib-PhilsLab.SchLib
C60 C61 = CMP-001-00113-3: Capacitor SMD 0603; Manufacturer: *; Rating: *; Distributor Link: *; Source: Schematic-Lib-PhilsLab.SchLib; Manufacturer Part Number: *; Dielectric: *; LCSC: *; Design Item ID: CAP_0603
J3-J8 J10 = CMP-002-00332-2: TE 5-146280-3, PCB Mount Header, Vertical, Board-to-Board, 3 Position, 2.54 mm [.1 in] Centerline, Breakaway, Gold, Through Hole - Solder, Signal, AMPMODU Headers
J9 = CMP-002-00330-3: TE 5-146280-2, PCB Mount Header, Vertical, Board-to-Board, 2 Position, 2.54 mm [.1 in] Centerline, Breakaway, Gold, Through Hole - Solder, Signal, AMPMODU Headers
R27-R34 = CMP-009-00179-5: Resistor 0603 100mW 1%; LCSC: *; Value: 2k2; Distributor Link: *; Manufacturer Part Number: *; Design Item ID: RES_0603; Manufacturer: *; Source: Schematic-Lib-PhilsLab.SchLib
TP13-TP15 = CMP-002-00037-2: as TP12 on sheet MCU; Colour: Orange; Packaging: Bulk; Package Description: 1-Pin Through Hole Device, Dia 2.54 mm; Pins: 1; Package Reference: 5003; Datasheet Version: Jun-15; Case/Package: 5003; Mounting Technology: TH; Connector Type: TestPoint; Diameter: 2.54mm; Contact Material: Bronze; Datasheet URL: http://keyelco.com/userAssets/file/M65p56.pdf; Manufacturer URL: http://www.keyelco.com/; Package Quantity: 10; Contact Plating: Tin; RoHS Compliant: True
U3 = CMP-1595-00004-2: 16-Channel, 12-Bit PWM Fm+ I2C-Bus LED Controller, 2.3 to 5.5 V, -40 to 85 degC, 28-Pin TSSOP (SOT361-1), RoHS, Tape and Reel; Supply Current Max: 10 mA; Supply Voltage Min: 2.3 V; Supply Voltage Max: 5.5 V; Frequency: 25000000 Hz; Temperature Min: -40 degC; PackageDescription: 28-Pin Small Outline Package, Body 9.7 x 4.4 mm, Pitch 0.65 mm; RoHS: TRUE; ComponentLink1Description: Manufacturer URL; Code_JEDEC: MO-153; PartNumber: PCA9685; ComponentLink2URL: http://www.nxp.com/documents/data_sheet/PCA9685.pdf; Packing: Tape and Reel; ComponentLink1URL: http://www.nxp.com/; ComponentLink3Description: Package Specification; ComponentLink2Description: Datasheet; ComponentLink3URL: http://www.nxp.com/documents/outline_drawing/sot361-1_po.pdf; DatasheetVersion: Rev. 4; Temperature Max: 85 degC; PackageVersion: 02/2003; Mounting Technology: Surface Mount
U8 = CMP-019-00050-1: Fixed Positive LDO Regulator, 5.0V, 1.3V Dropout, PDSO3; Pins: 3; Case/Package: SOP; RoHS Compliant: Yes

## Sheet USB_PD_Controller.SchDoc
size A3; SheetNumber: 2; SheetTotal: 8
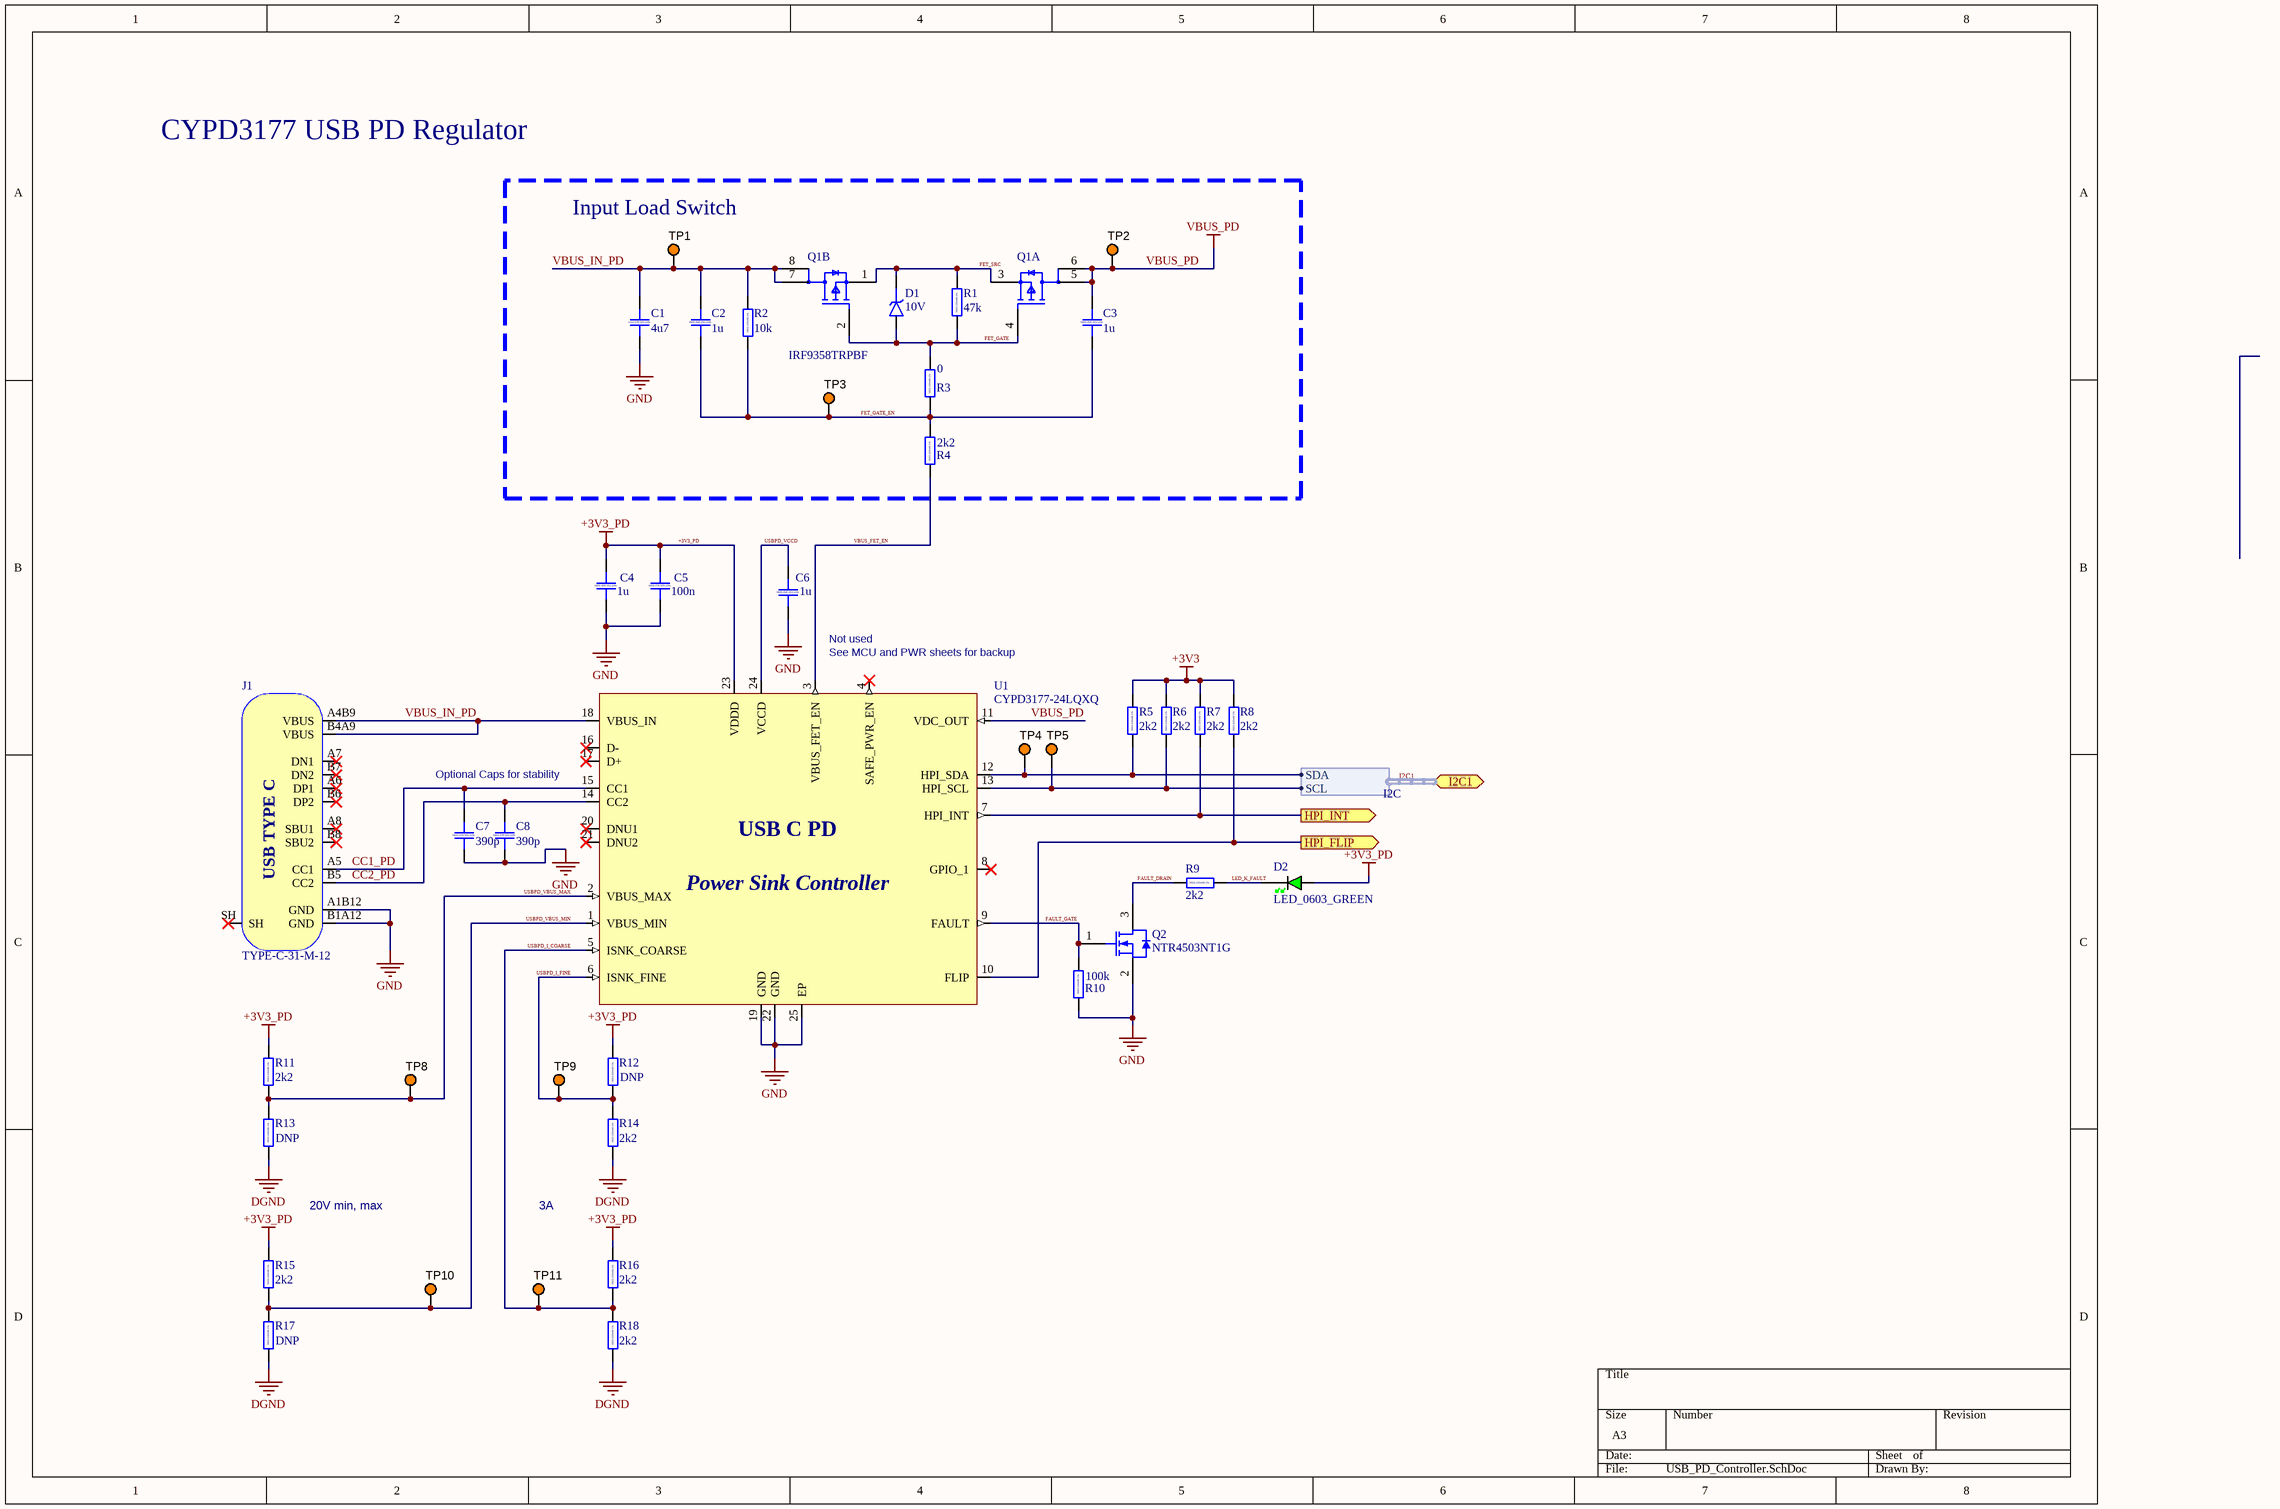
[diagram p5: USB_PD_Controller.SchDoc]

### Parts
C1  4u7  [CAP_1210]
C2  1u  [CAP_0805]
C3  1u  [CAP_0805]
C4  1u  [CAP_0805]
C5  100n  [CAP_0603]
C6  1u  [CAP_0805]
C7  390p  [CAP_0603]
C8  390p  [CAP_0603]
D1  10V  [SOD-323]
D2  LED_0603_GREEN  [LED_0603_GREEN]
J1  TYPE-C-31-M-12  [TYPE-C-31-M-12]
Q1  IRF9358TRPBF  [FP-PG-DSO-8-IPC_A]  (value not drawn)  (parts A,B of 2)
Q2  NTR4503NT1G  [ONSC-SOT-23-3-318-08_V]
R1  47k  [RES_0603]
R2  10k  [RES_0603]
R3  0  [RES_0603]
R4  2k2  [RES_0603]
R5  2k2  [RES_0603]
R6  2k2  [RES_0603]
R7  2k2  [RES_0603]
R8  2k2  [RES_0603]
R9  2k2  [RES_0603]
R10  100k  [RES_0603]
R11  2k2  [RES_0603]
R12  DNP  [RES_0603]  (no BOM)
R13  DNP  [RES_0603]  (no BOM)
R14  2k2  [RES_0603]
R15  2k2  [RES_0603]
R16  2k2  [RES_0603]
R17  DNP  [RES_0603]  (no BOM)
R18  2k2  [RES_0603]
TP1  5003  [KSTN-5003]  (value not drawn)
TP2  5003  [KSTN-5003]  (value not drawn)
TP3  5003  [KSTN-5003]  (value not drawn)
TP4  5003  [KSTN-5003]  (value not drawn)
TP5  5003  [KSTN-5003]  (value not drawn)
TP8  5003  [KSTN-5003]  (value not drawn)
TP9  5003  [KSTN-5003]  (value not drawn)
TP10  5003  [KSTN-5003]  (value not drawn)
TP11  5003  [KSTN-5003]  (value not drawn)
U1  CYPD3177-24LQXQ  [QFN-24-0MM5]

### Blocks framed on the sheet
Input Load Switch: C1-C3 D1 Q1 R1-R4 TP1-TP3

### Ports
HPI_FLIP (out), HPI_INT (out), I2C1 (bidir, harness I2C)

### Harnesses
I2C: SCL, SDA

### Nets
+3V3: R5.2 R6.2 R7.2 R8.2
+3V3_PD: C4.2 C5.1 D2.A R11.2 R12.2 R15.2 R16.2 U1.23(VDDD)
DGND: R13.1 R14.1 R17.1 R18.1
GND: C1.1 C4.1 C5.2 C6.1 C7.2 C8.2 J1.A1B12(GND) J1.B1A12(GND) Q2.2(S) R10.1 U1.19(GND) U1.22(GND) U1.25(EP)
VBUS_PD: C3.2 Q1.5(D1) Q1.6(D1) TP2.1 U1.11(VDC_OUT)
CC1_PD: C7.1 J1.A5(CC1) U1.15(CC1)
CC2_PD: C8.1 J1.B5(CC2) U1.14(CC2)
FAULT_DRAIN: Q2.3(D) R9.1
FAULT_GATE: Q2.1(G) R10.2 U1.9(FAULT)
FET_GATE: D1.A Q1.2(G2) Q1.4(G1) R1.1 R3.2
FET_GATE_EN: C2.1 C3.1 R2.1 R3.1 R4.2 TP3.1
FET_SRC: D1.K Q1.1(S2) Q1.3(S1) R1.2
FLIP: R8.1 U1.10(FLIP) ; port HPI_FLIP
HPI_INT: R7.1 U1.7(HPI_INT) ; port HPI_INT
I2C1.SCL: R6.1 TP5.1 U1.13(HPI_SCL) ; port I2C1.SCL
I2C1.SDA: R5.1 TP4.1 U1.12(HPI_SDA) ; port I2C1.SDA
USBPD_I_COARSE: R16.1 R18.2 TP11.1 U1.5(ISNK_COARSE)
USBPD_I_FINE: R12.1 R14.2 TP9.1 U1.6(ISNK_FINE)
USBPD_VBUS_MAX: R11.1 R13.2 TP8.1 U1.2(VBUS_MAX)
USBPD_VBUS_MIN: R15.1 R17.2 TP10.1 U1.1(VBUS_MIN)
USBPD_VCCD: C6.2 U1.24(VCCD)
VBUS_FET_EN: R4.1 U1.3(VBUS_FET_EN)
VBUS_IN_PD: C1.2 C2.2 J1.A4B9(VBUS) J1.B4A9(VBUS) Q1.7(D2) Q1.8(D2) R2.2 TP1.1 U1.18(VBUS_IN)
NetD2_K: D2.K R9.2

Not connected (* = marked no-connect by the designer): J1 A6(DP1)* A7(DN1)* A8(SBU1)* B6(DP2)* B7(DN2)* B8(SBU2)* SH*; U1 4(SAFE_PWR_EN)* 8(GPIO_1)* 16(D-)* 17(D+)* 20(DNU1)* 21(DNU2)*

### Buses and harness runs
harness I2C1 = port I2C1

### Notes on the sheet
- CYPD3177 USB PD Regulator
- Not used
- (near U1) See MCU and PWR sheets for backup
- Optional Caps for stability
- 20V min, max
- 3A
- Labels drawn without touching a wire or pin: LED_K_FAULT
- (in symbol CMP-001-00113-3) 0603 X7R 50V 10%
- (in symbol CMP-001-38826-1) 0805 X5R 25V 10%
- (in symbol CMP-001-38827-2) 1210 X7R 50V 10%
- (in symbol CMP-002-00119-1) USB TYPE C
- (in symbol CMP-009-00179-5) 0603 100mW 1%
- (in symbol CMP-024-000234-1) USB C PD; Power Sink Controller

### Library data of the parts
C1 = CMP-001-38827-2: Capacitor SMD 1210; Value: 4u7; Design Item ID: CAP_1210; Manufacturer: *; Source: Schematic-Lib-PhilsLab.SchLib; Manufacturer Part Number: *; Distributor Link: *; Rating: *; Dielectric: *; LCSC: *
C2-C4 C6 = CMP-001-38826-1: Capacitor SMD 0805; Manufacturer Part Number: *; Rating: *; Dielectric: *; Design Item ID: CAP_0805; Manufacturer: *; Value: 1u; Distributor Link: *; LCSC: *; Source: Schematic-Lib-PhilsLab.SchLib
C5 C7 C8 = CMP-001-00113-3: Capacitor SMD 0603; LCSC: *; Rating: *; Dielectric: *; Design Item ID: CAP_0603; Distributor Link: *; Manufacturer: *; Source: Schematic-Lib-PhilsLab.SchLib; Manufacturer Part Number: *
  C5: Value: 100n
  C7 C8: Value: 390p
D1 = CMP-004-00053-1: Diode Zener SMD SOD-323; Source: Schematic-Lib-PhilsLab.SchLib; Design Item ID: D_ZENER_SOD_323
D2 = CMP-004-00051-1: LED 0603 GREEN SMD; Source: Schematic-Lib-PhilsLab.SchLib; Design Item ID: LED_0603_GREEN
J1 = CMP-002-00119-1: as J2 on sheet MCU; Source: Schematic-Lib-PhilsLab.SchLib; Manufacturer Part Number: TYPE-C-31-M-12; Design Item ID: TYPE-C-31-M-12
Q1 = CMP-32901-000912-1: MOSFET 2P-CH 30V 9.2A 8SOIC; Max Dual Supply Voltage: -30V; Max Power Dissipation: 2W; Rds On Max: 16.3mR; Threshold Voltage: -1.8V; Input Capacitance: 1.74nF; Packaging: Cut Tape; Min Operating Temperature: -55°C; Series: HEXFET®; Mount: Surface Mount; Max Operating Temperature: 150°C; Lead Free: Lead Free; Halogen Free: Halogen Free; Continuous Drain Current (ID): 9.2A; Drain to Source Voltage (Vdss): -30V; Case/Package: SO; Number of Pins: 8; RoHS Compliant: Yes
Q2 = CMP-1058-00742-1: Power MOSFET, 30 V, 2.5 A, Single N-Channel, 3-Pin SOT-23, Pb-Free, Tape and Reel; Manufacturer: On Semiconductor; Qrr Typ (nC): 4; ID Max (A): 2.5; VGS(th) Max (V): 3; VGS Max (V): 20; Channel Polarity: N Channel; V(BR)DSS Min (V): 30; ComponentLink3URL: http://www.onsemi.cn/pub_link/Collateral/318-08.PDF; PackageReference: SOT-23-3-318-08; ComponentLink2URL: http://www.onsemi.cn/pub_link/Collateral/NTR4503N-D.PDF; ComponentLink2Description: Datasheet; ComponentLink1Description: Manufacturer URL; Configuration: Single; ComponentLink1URL: http://www.onsemi.com/; PackageVersion: Rev. AP, 11/2009; Package Type: SOT-23-3; DatasheetVersion: Rev. 6; ComponentLink3Description: Package Specification; PartNumber: NTR4503NT1G; Packing: Tape and Reel; RoHS: Pb-Free; Mounting Technology: Surface Mount; PackageDescription: 3-Pin Small Outline Transistor, Body 2.92 x 1.3 mm, Pitch 0.95 mm
R1-R18 = CMP-009-00179-5: Resistor 0603 100mW 1%; LCSC: *; Distributor Link: *; Manufacturer Part Number: *; Design Item ID: RES_0603; Manufacturer: *; Source: Schematic-Lib-PhilsLab.SchLib
  R1: Value: 47k
  R2: Value: 10k
  R3: Value: 0
  R4-R9 R11 R14-R16 R18: Value: 2k2
  R10: Value: 100k
TP1-TP5 TP8-TP11 = CMP-002-00037-2: as TP12 on sheet MCU; Colour: Orange; Packaging: Bulk; Package Description: 1-Pin Through Hole Device, Dia 2.54 mm; Pins: 1; Package Reference: 5003; Datasheet Version: Jun-15; Case/Package: 5003; Mounting Technology: TH; Connector Type: TestPoint; Diameter: 2.54mm; Contact Material: Bronze; Datasheet URL: http://keyelco.com/userAssets/file/M65p56.pdf; Manufacturer URL: http://www.keyelco.com/; Package Quantity: 10; Contact Plating: Tin; RoHS Compliant: True
U1 = CMP-024-000234-1: USB Type-C Port Controller for Power Sinks; Manufacturer: Cypress Semicon; Distributor Link: https://www.lcsc.com/product-detail/USB-ICs_Cypress-Semicon-CYPD3177-24LQXQ_C2959321.html; Design Item ID: CYPD3177-24LQXQ; Source: Schematic-Lib-PhilsLab.SchLib; Manufacturer Part Number: CYPD3177-24LQXQ

## Sheet Mechanical.SchDoc
size A4; SheetNumber: 7; SheetTotal: 8
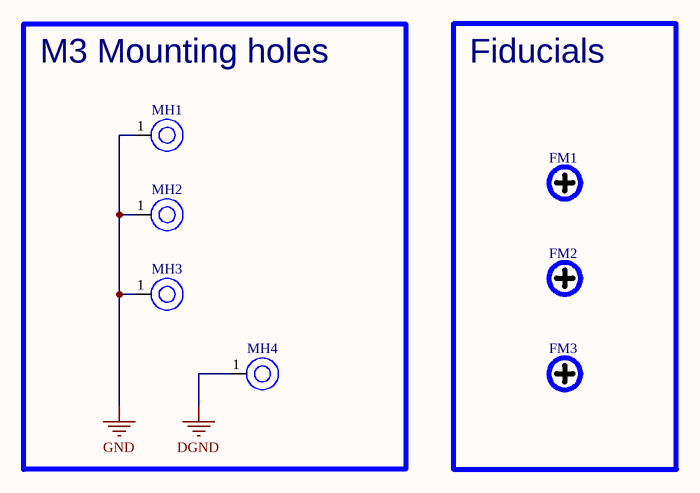
[diagram p6: Mechanical.SchDoc]

### Parts
FM1  FIDUCIAL_CROSS_1MM5  [FIDUCIAL_CROSS_1MM5]  (value not drawn)  (no BOM)
FM2  FIDUCIAL_CROSS_1MM5  [FIDUCIAL_CROSS_1MM5]  (value not drawn)  (no BOM)
FM3  FIDUCIAL_CROSS_1MM5  [FIDUCIAL_CROSS_1MM5]  (value not drawn)  (no BOM)
MH1  MTHP3P2MM  [MTHP3P2MM-Footprint-1]  (value not drawn)
MH2  MTHP3P2MM  [MTHP3P2MM-Footprint-1]  (value not drawn)
MH3  MTHP3P2MM  [MTHP3P2MM-Footprint-1]  (value not drawn)
MH4  MTHP3P2MM  [MTHP3P2MM-Footprint-1]  (value not drawn)

### Blocks framed on the sheet
M3 Mounting holes: MH1-MH4
Fiducials: FM1-FM3

### Nets
DGND: MH4.1
GND: MH1.1 MH2.1 MH3.1

### Library data of the parts
FM1-FM3 = CMP-020-000009-1: Fiducial Marker Cross 1.5mm NO BOM; Design Item ID: FIDUCIAL_CROSS_1MM5; Source: Schematic-Lib-PhilsLab.SchLib
MH1-MH4 = CMP-00028-00009-2: Mounting Hole Plated 3.2 mm drill

## Sheet Connectors.SchDoc
size A4; SheetNumber: 8; SheetTotal: 8
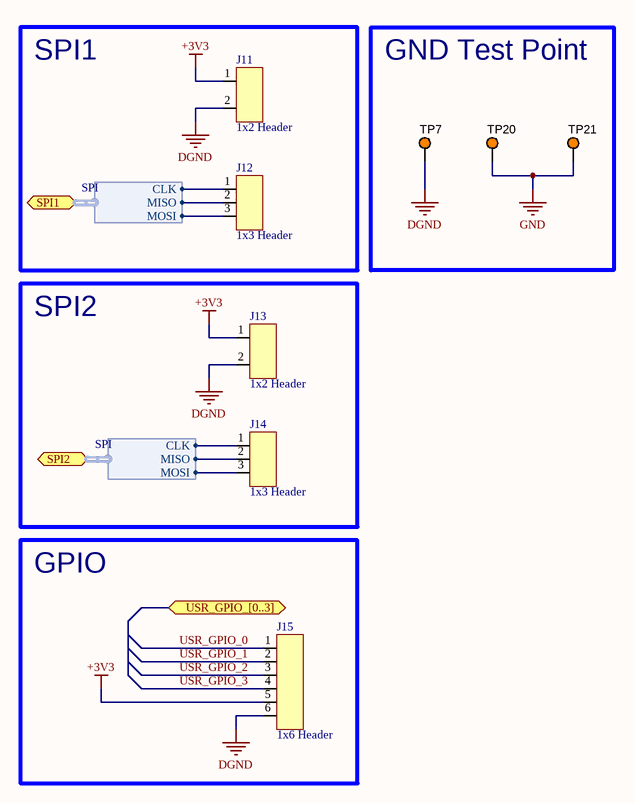
[diagram p7: Connectors.SchDoc]

### Parts
J11  1x2 Header  [1x2 Header-Footprint-1]
J12  1x3 Header  [1x4 Header-Footprint-1]
J13  1x2 Header  [1x2 Header-Footprint-1]
J14  1x3 Header  [1x4 Header-Footprint-1]
J15  1x6 Header  [1x6 Header-Footprint-1]
TP7  5003  [KSTN-5003]  (value not drawn)
TP20  5003  [KSTN-5003]  (value not drawn)
TP21  5003  [KSTN-5003]  (value not drawn)

### Blocks framed on the sheet
SPI1: J11 J12
GND Test Point: TP7 TP20 TP21
SPI2: J13 J14
GPIO: J15

### Ports
SPI1 (bidir, harness SPI), SPI2 (bidir, harness SPI), USR_GPIO_[0..3] (bidir)

### Harnesses
SPI: CLK, MISO, MOSI

### Nets
+3V3: J11.1 J13.1 J15.5
DGND: J11.2 J13.2 J15.6 TP7.1
GND: TP20.1 TP21.1
SPI1_CLK: J12.1 ; port SPI1.CLK
SPI1_MISO: J12.2 ; port SPI1.MISO
SPI1_MOSI: J12.3 ; port SPI1.MOSI
SPI2.CLK: J14.1 ; port SPI2.CLK
SPI2.MISO: J14.2 ; port SPI2.MISO
SPI2.MOSI: J14.3 ; port SPI2.MOSI
USR_GPIO_0: J15.1
USR_GPIO_1: J15.2
USR_GPIO_2: J15.3
USR_GPIO_3: J15.4

### Library data of the parts
J11 J13 = CMP-002-00330-3: as J9 on sheet Servo_controller
J12 J14 = CMP-002-00332-2: as J3 on sheet Servo_controller
J15 = CMP-002-00329-3: TE 5-146280-6, PCB Mount Header, Vertical, Board-to-Board, 6 Position, 2.54 mm [.1 in] Centerline, Breakaway, Gold, Through Hole - Solder, Signal, Black, Carton
TP7 TP20 TP21 = CMP-002-00037-2: as TP12 on sheet MCU; Colour: Orange; Packaging: Bulk; Package Description: 1-Pin Through Hole Device, Dia 2.54 mm; Pins: 1; Package Reference: 5003; Datasheet Version: Jun-15; Case/Package: 5003; Mounting Technology: TH; Connector Type: TestPoint; Diameter: 2.54mm; Contact Material: Bronze; Datasheet URL: http://keyelco.com/userAssets/file/M65p56.pdf; Manufacturer URL: http://www.keyelco.com/; Package Quantity: 10; Contact Plating: Tin; RoHS Compliant: True

## Nets that join several sheets
+3V3: MCU (CN1.3 SW2.34), PWR (20 pins), RF_Antenna (C56.1 C57.1 U2.33), Servo_controller (R27.2 R28.2), USB_PD_Controller (R5.2 R6.2 R7.2 R8.2), Connectors (J11.1 J13.1 J15.5)
+5V: MCU (C15.1 L1.2 TP12.1), PWR (7 pins)
+6V: PWR (5 pins), Servo_controller (10 pins)
+8V: PWR (5 pins), Servo_controller (5 pins)
DGND: MCU (19 pins), PWR (9 pins), RF_Antenna (9 pins), Servo_controller (10 pins), USB_PD_Controller (R13.1 R14.1 R17.1 R18.1), Mechanical (MH4.1), Connectors (J11.2 J13.2 J15.6 TP7.1)
GND: MCU (6 pins), PWR (51 pins), Servo_controller (15 pins), USB_PD_Controller (13 pins), Mechanical (MH1.1 MH2.1 MH3.1), Connectors (TP20.1 TP21.1)
VBUS_PD: PWR (10 pins), Servo_controller (C60.1 U8.3), USB_PD_Controller (5 pins)
FLIP: MCU (U2.2), USB_PD_Controller (R8.1 U1.10)
HPI_INT: MCU (U2.65), USB_PD_Controller (R7.1 U1.7)
I2C1.SCL: MCU (U2.6), USB_PD_Controller (R6.1 TP5.1 U1.13)
I2C1.SDA: MCU (U2.7), USB_PD_Controller (R5.1 TP4.1 U1.12)
I2C2.SCL: MCU (U2.47), Servo_controller (R27.1 TP13.1 U3.26)
I2C2.SDA: MCU (U2.48), Servo_controller (R28.1 TP14.1 U3.27)
MCU_OE: MCU (U2.49), Servo_controller (TP15.1 U3.23)
PMUX_ST: MCU (U2.51), PWR (R37.1 TP17.1 U4.9)
SPI1_CLK: MCU (U2.20), Connectors (J12.1)
SPI1_MISO: MCU (U2.21), Connectors (J12.2)
SPI1_MOSI: MCU (U2.22), Connectors (J12.3)
SPI2.CLK: MCU (U2.24), Connectors (J14.1)
SPI2.MISO: MCU (U2.11), Connectors (J14.2)
SPI2.MOSI: MCU (U2.12), Connectors (J14.3)